# EAGLE design Versie 4 (EAGLE 7.3.0)

## Sheet 1 of 7: OVERVIEW
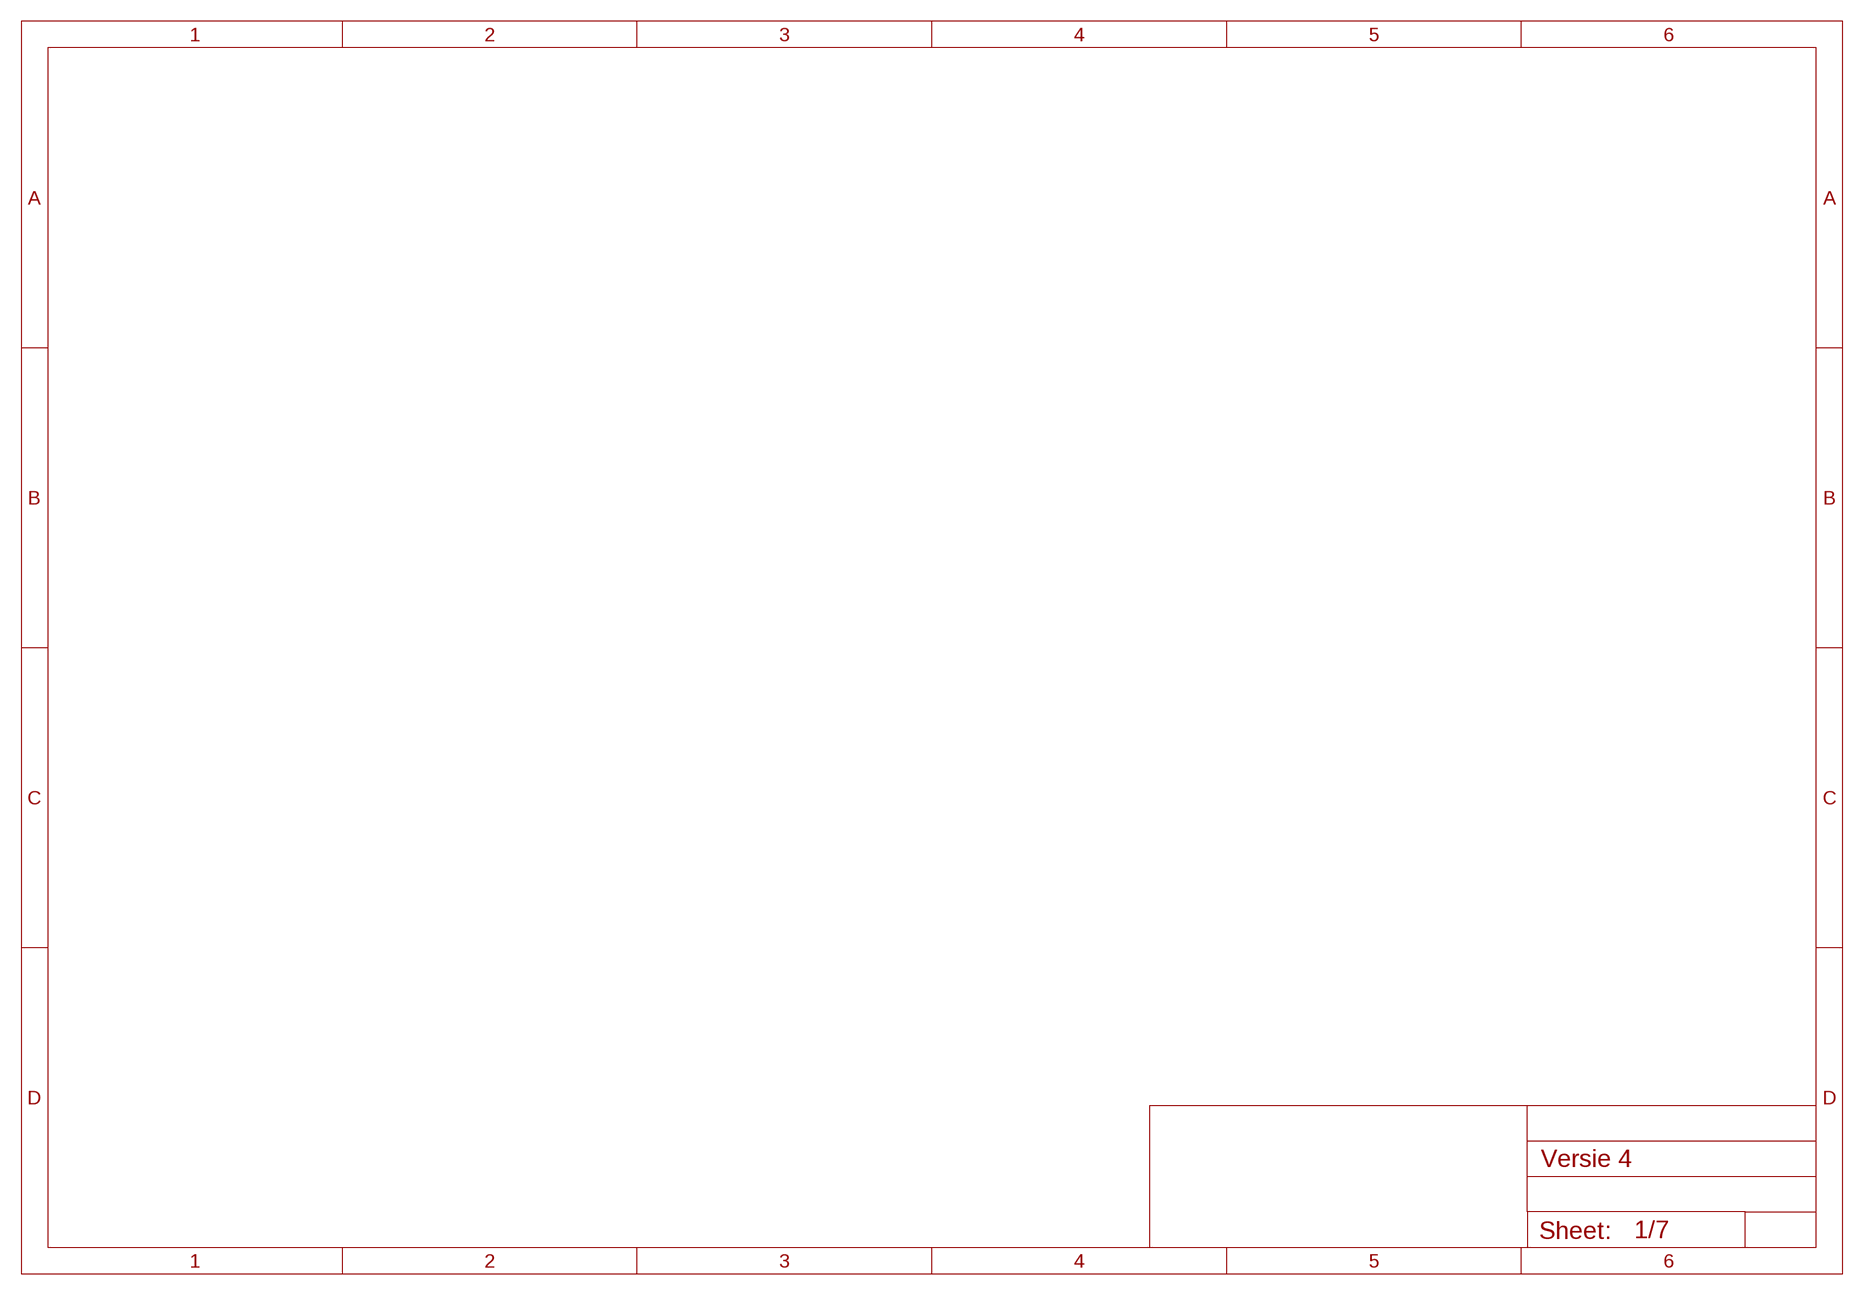
[diagram p0: schematic, sheet 1]

## Sheet 2 of 7: POWER
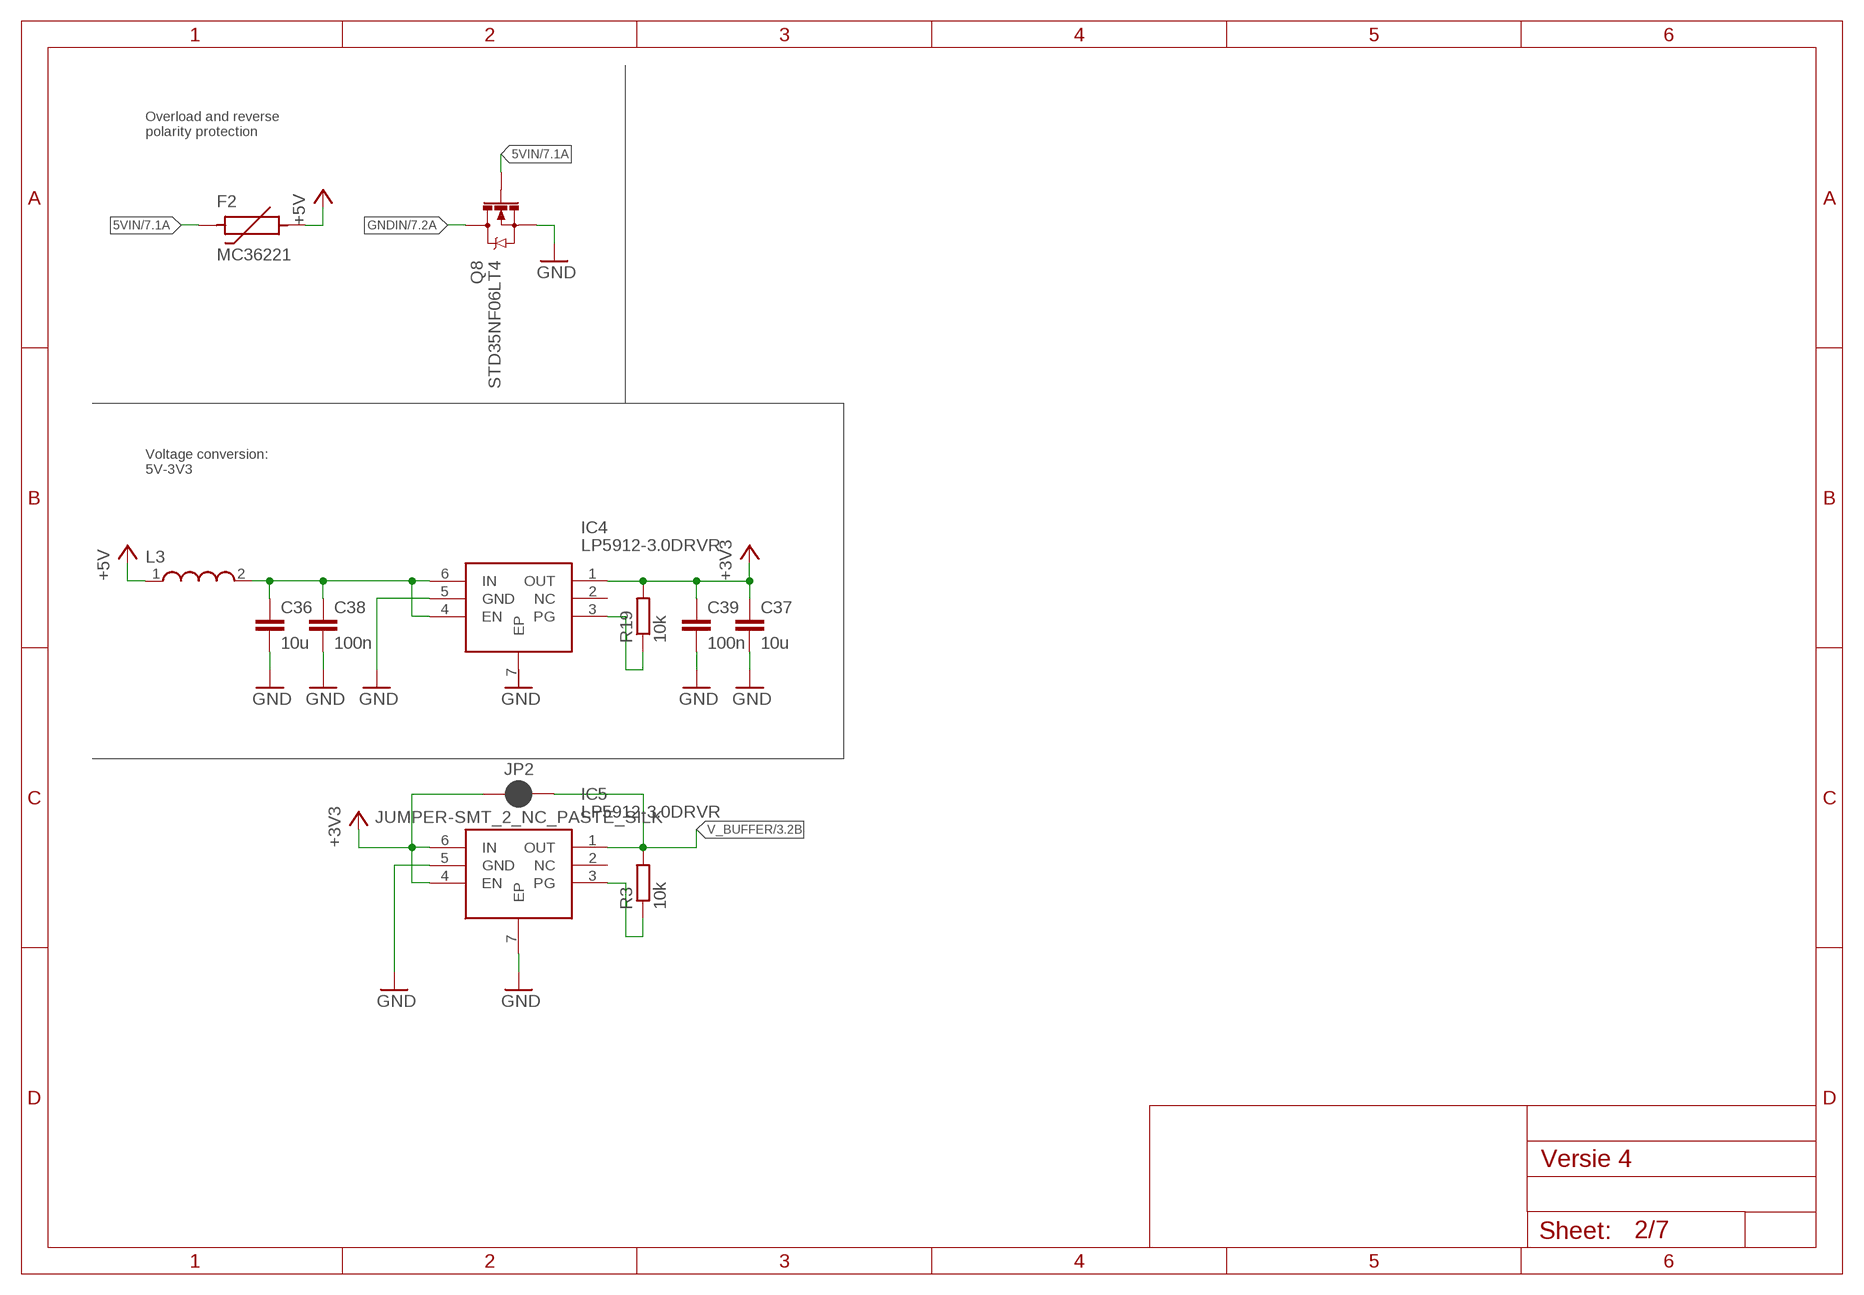
[diagram p1: schematic, sheet 2]

### Parts
C36  10u  C-EUC0603  [C0603]
C37  10u  C-EUC0603  [C0603]
C38  100n  C-EUC0603  [C0603]
C39  100n  C-EUC0603  [C0603]
F2  MC36221  [1206]
IC4  LP5912-3.0DRVR  [SON65P200X200X80-7N]
IC5  LP5912-3.0DRVR  [SON65P200X200X80-7N]
JP2  JUMPER-SMT_2_NC_PASTE_SILK  [SMT-JUMPER_2_NC_PASTE_SILK]
L3  WE-CBA_0603(WB/HS)  [WE-CBA_0603(W=2.2)]
Q8  STD35NF06LT4  MOSFET-NCHANNEL_SOT23-3  [SOT23-3]
R3  10k  R-EU_R0603  [R0603]
R19  10k  R-EU_R0603  [R0603]

### Nets
5VIN: F2.P$1 Q8.1(G) ; also sheet 7
+3V3: C37.1 C39.1 IC4.1(OUT) IC5.4(EN) IC5.6(IN) JP2.1 R19.2 ; also sheet 4,5,6,7
+5V: F2.P$2 L3.1
GND: C36.2 C37.2 C38.2 C39.2 IC4.5(GND) IC5.5(GND) IC5.7(EP) Q8.2(S) ; also sheet 3,4,5,6,7
GNDIN: Q8.3(D) ; also sheet 7
N$11: IC5.3(PG) R3.1
N$28: C36.1 C38.1 IC4.4(EN) IC4.6(IN) L3.2
N$29: IC4.3(PG) R19.1
V_BUFFER: IC5.1(OUT) JP2.2 R3.2 ; also sheet 3,4
Unconnected: IC4.2(NC) IC4.7(EP) IC5.2(NC)

### Notes on the sheet
- Overload and reverse
  polarity protection
- Voltage conversion:
  5V-3V3

## Sheet 3 of 7: PPS IN
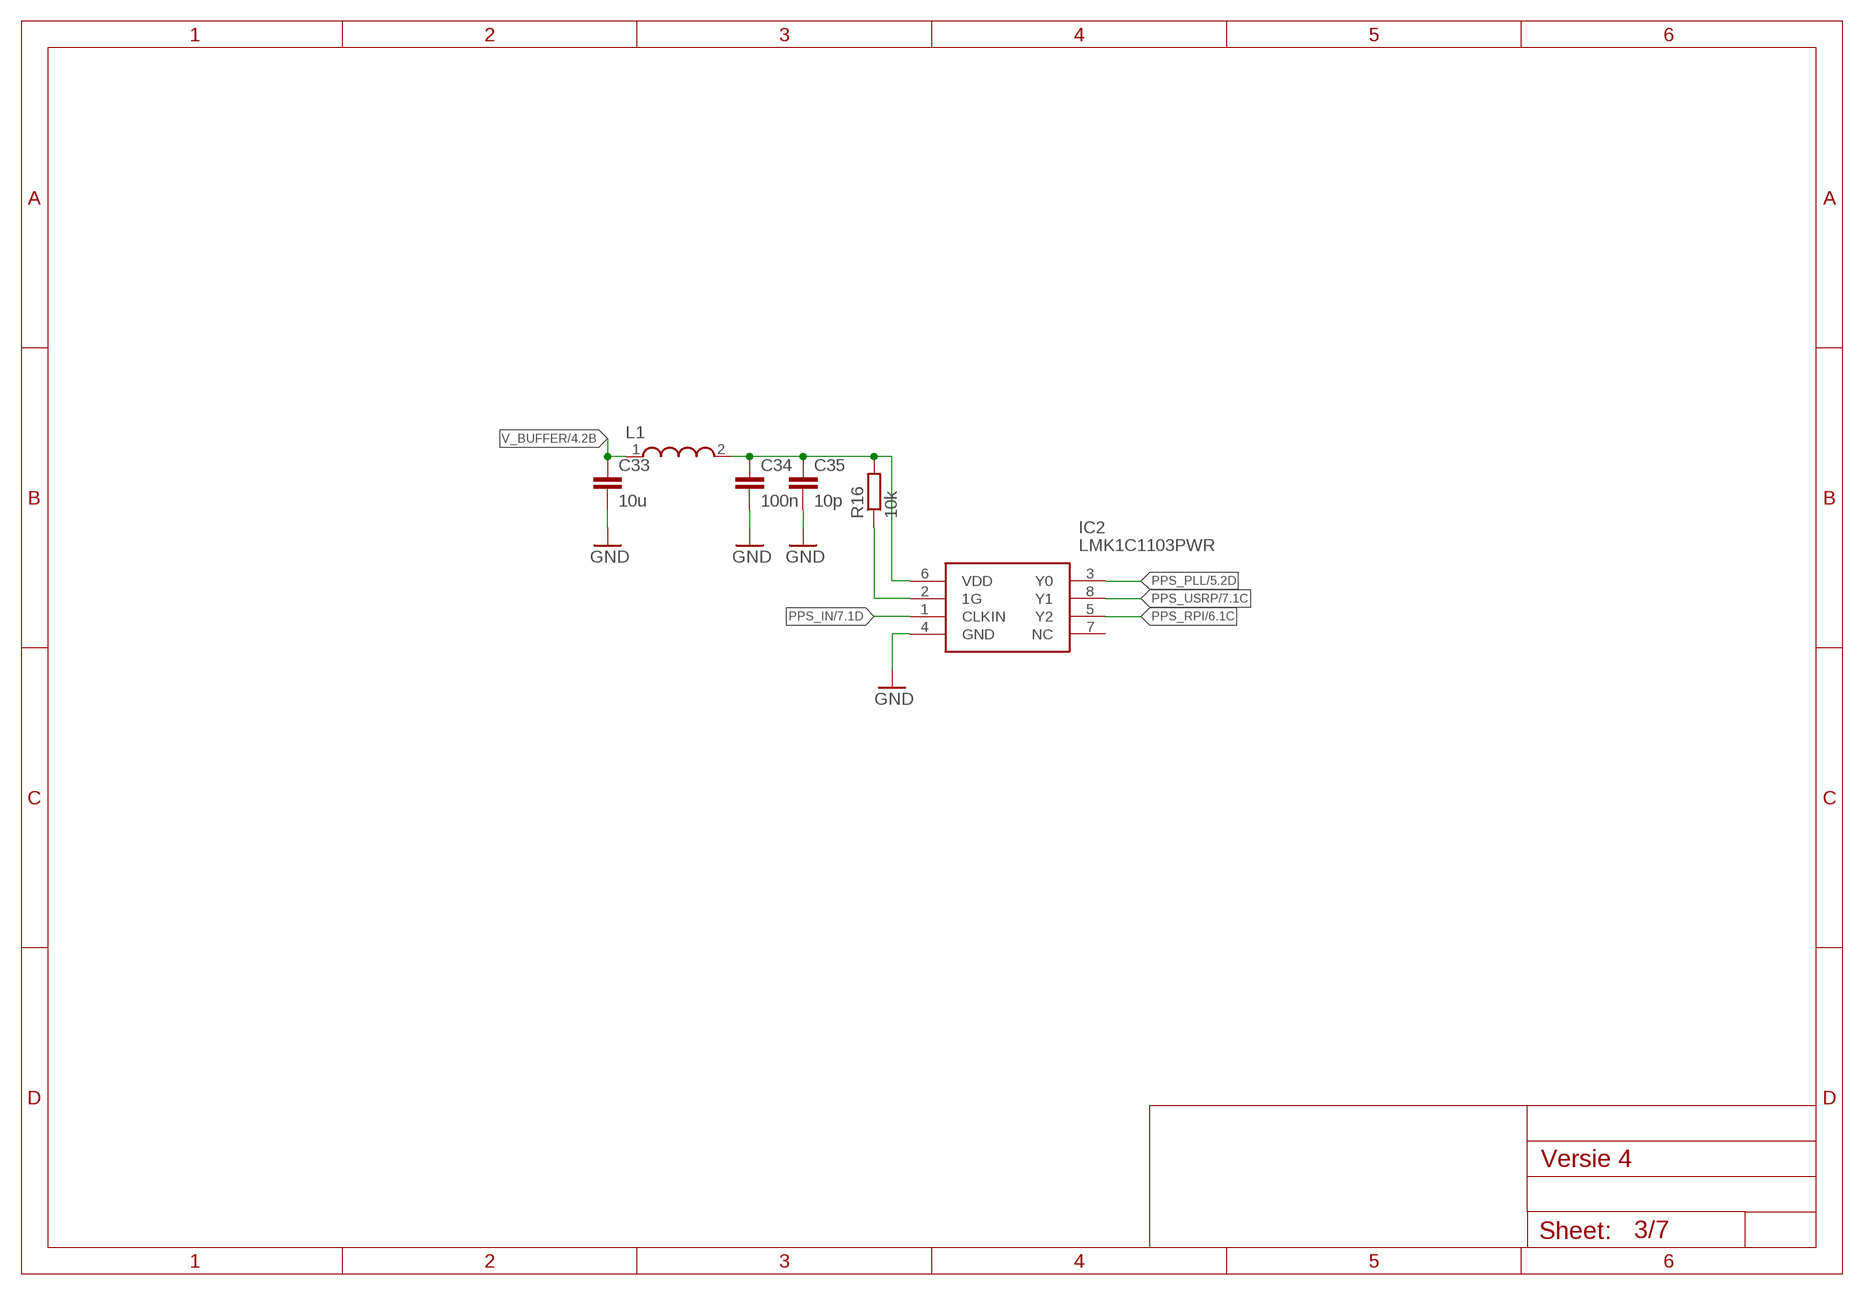
[diagram p2: schematic, sheet 3]

### Parts
C33  10u  C-EUC0603  [C0603]
C34  100n  C-EUC0603  [C0603]
C35  10p  C-EUC0603  [C0603]
IC2  LMK1C1103PWR  [SOP65P640X120-8N]
L1  WE-CBA_0603(WB/HS)  [WE-CBA_0603(W=2.2)]
R16  10k  R-EU_R0603  [R0603]

### Nets
GND: C33.2 C34.2 C35.2 IC2.4(GND) ; also sheet 2,4,5,6,7
N$22: IC2.2(1G) R16.1
N$24: C34.1 C35.1 IC2.6(VDD) L1.2 R16.2
PPS_IN: IC2.1(CLKIN) ; also sheet 7
PPS_PLL: IC2.3(Y0) ; also sheet 5
PPS_RPI: IC2.5(Y2) ; also sheet 6,7
PPS_USRP: IC2.8(Y1) ; also sheet 7
V_BUFFER: C33.1 L1.1 ; also sheet 2,4
Unconnected: IC2.7(NC)

## Sheet 4 of 7: 10MHz IN
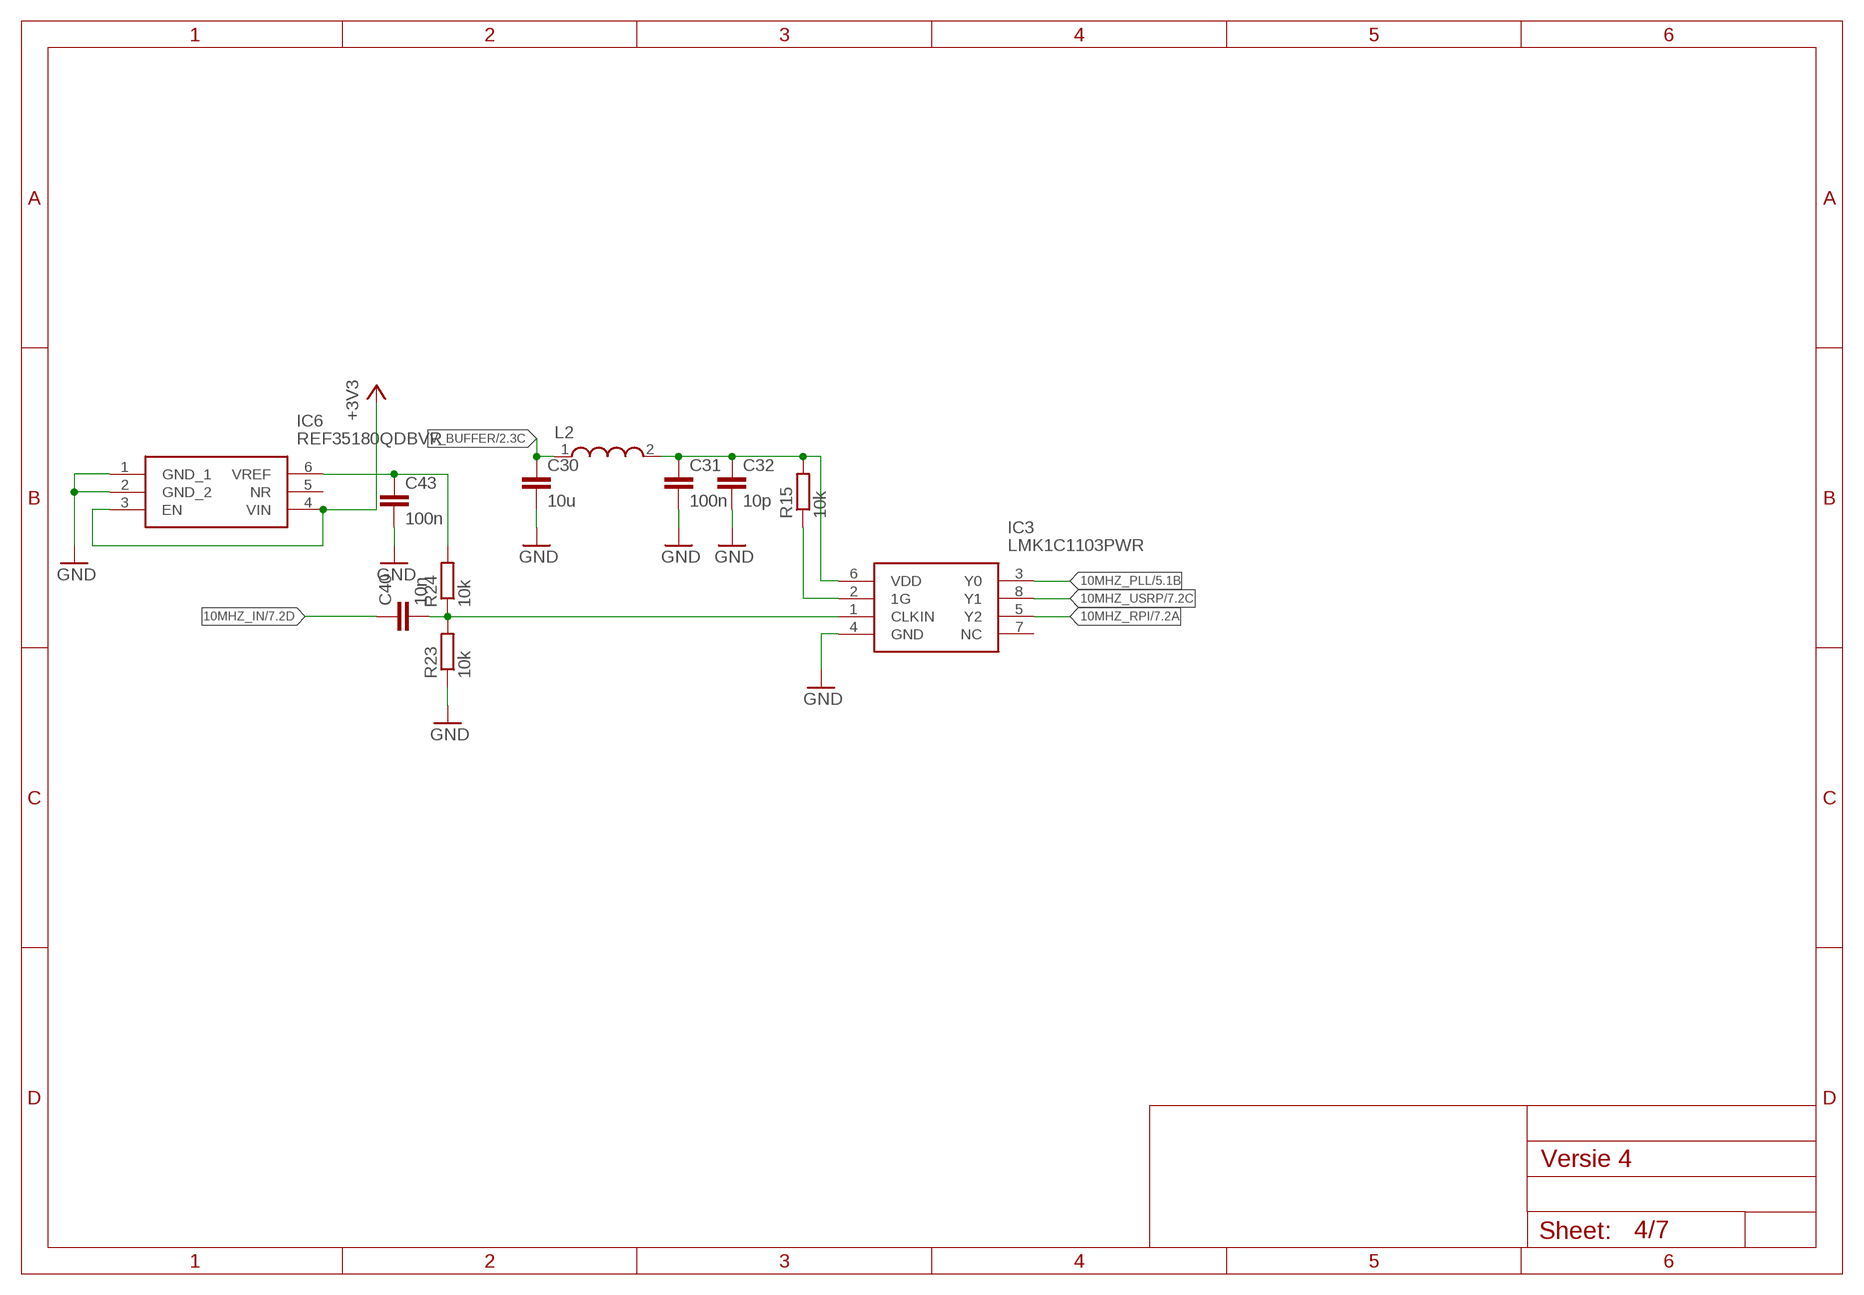
[diagram p3: schematic, sheet 4]

### Parts
C30  10u  C-EUC0603  [C0603]
C31  100n  C-EUC0603  [C0603]
C32  10p  C-EUC0603  [C0603]
C40  10n  C-EUC0603  [C0603]
C43  100n  C-EUC0603  [C0603]
IC3  LMK1C1103PWR  [SOP65P640X120-8N]
IC6  REF35180QDBVR  [SOT95P280X145-6N]
L2  WE-CBA_0603(WB/HS)  [WE-CBA_0603(W=2.2)]
R15  10k  R-EU_R0603  [R0603]
R23  10k  R-EU_R0603  [R0603]
R24  10k  R-EU_R0603  [R0603]

### Nets
10MHZ_IN: C40.1 ; also sheet 7
10MHZ_PLL: IC3.3(Y0) ; also sheet 5
10MHZ_RPI: IC3.5(Y2) ; also sheet 7
10MHZ_USRP: IC3.8(Y1) ; also sheet 7
+3V3: IC6.3(EN) IC6.4(VIN) ; also sheet 2,5,6,7
GND: C30.2 C31.2 C32.2 C43.2 IC3.4(GND) IC6.1(GND_1) IC6.2(GND_2) R23.1 ; also sheet 2,3,5,6,7
N$23: C40.2 IC3.1(CLKIN) R23.2 R24.1
N$25: IC3.2(1G) R15.1
N$27: C31.1 C32.1 IC3.6(VDD) L2.2 R15.2
N$30: C43.1 IC6.6(VREF) R24.2
V_BUFFER: C30.1 L2.1 ; also sheet 2,3
Unconnected: IC3.7(NC) IC6.5(NR)

## Sheet 5 of 7: PLL
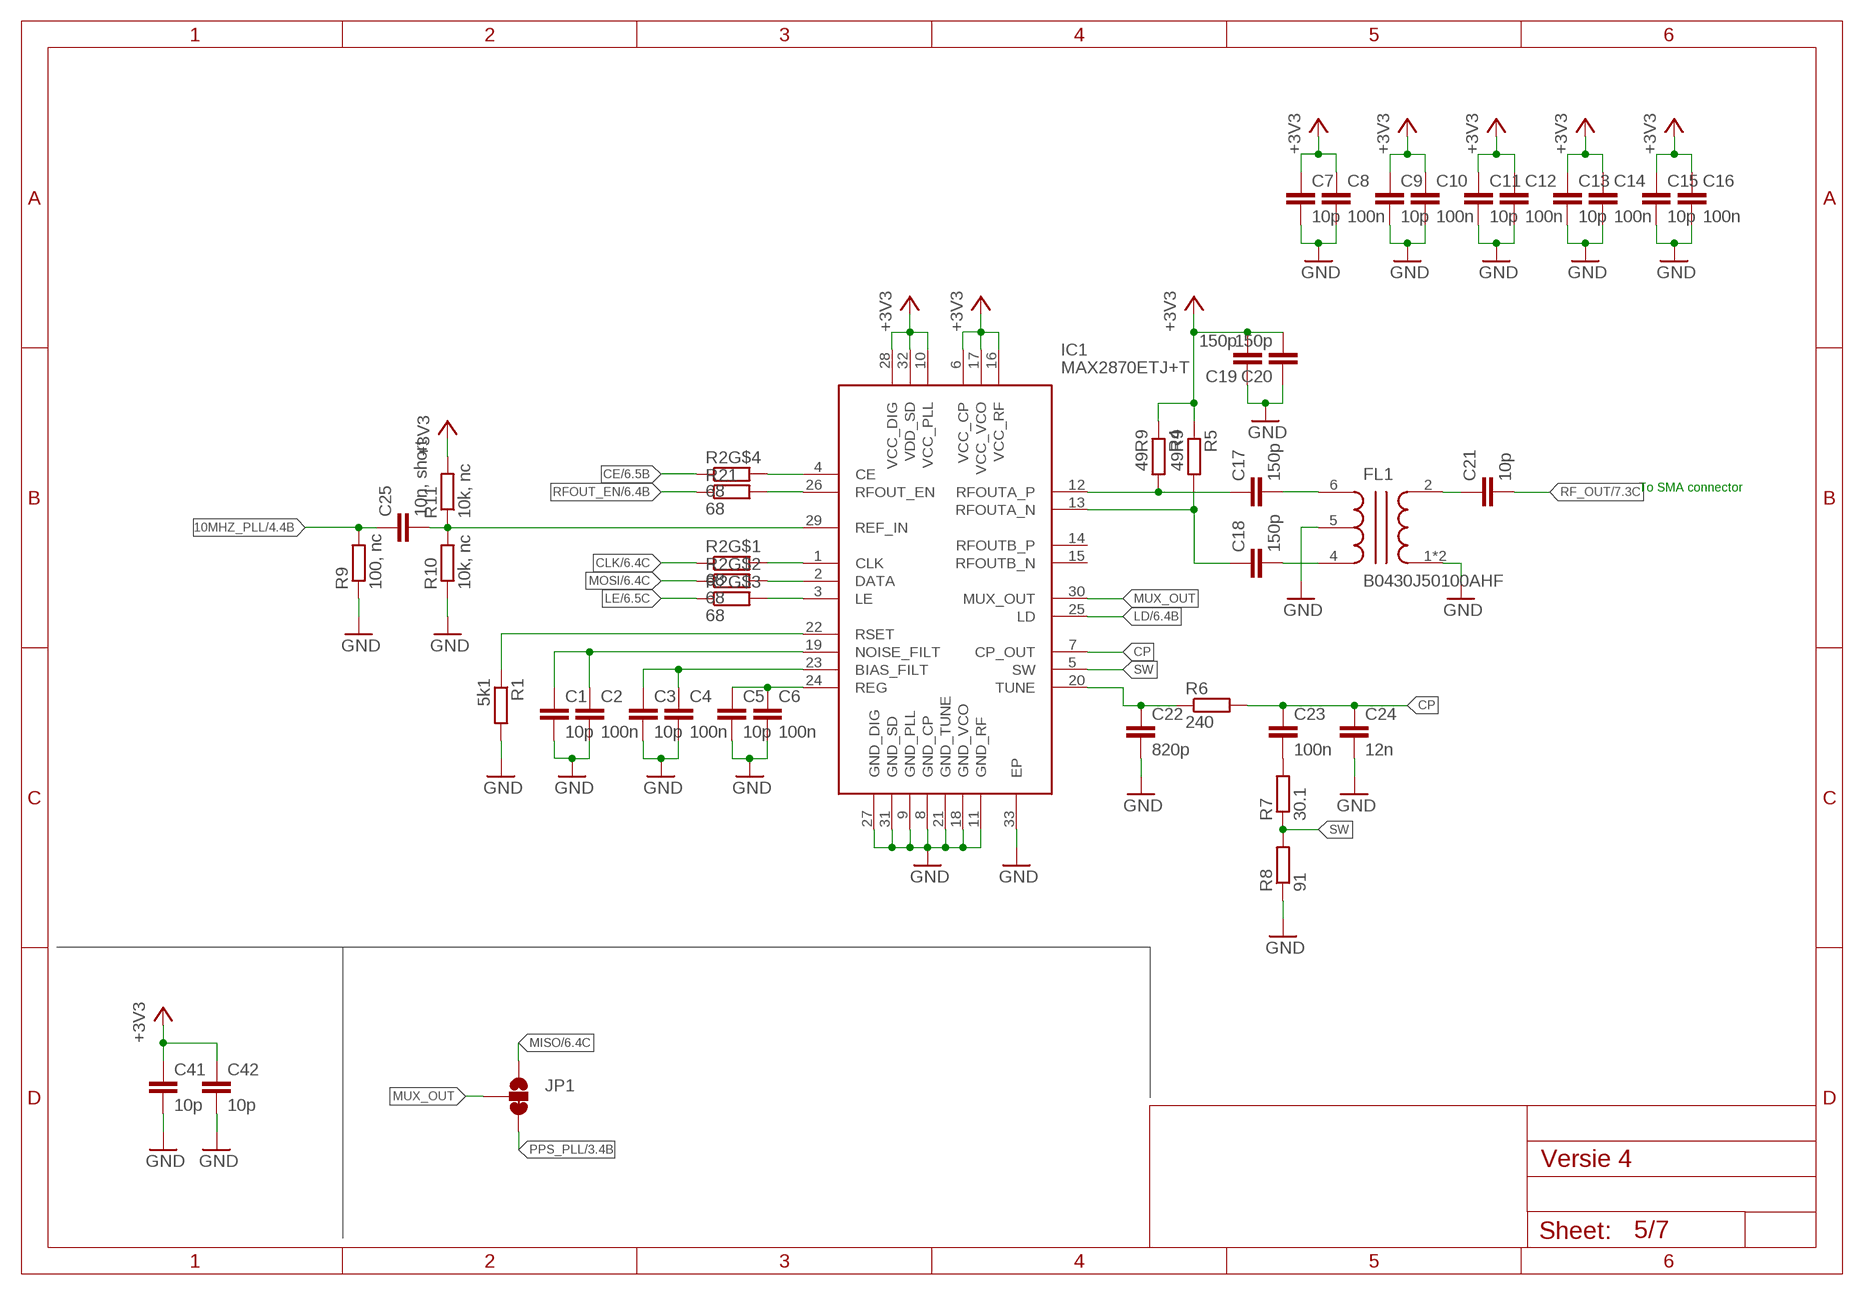
[diagram p4: schematic, sheet 5]

### Parts
C1  10p  C-EUC0603  [C0603]
C2  100n  C-EUC0603  [C0603]
C3  10p  C-EUC0603  [C0603]
C4  100n  C-EUC0603  [C0603]
C5  10p  C-EUC0603  [C0603]
C6  100n  C-EUC0603  [C0603]
C7  10p  C-EUC0603  [C0603]
C8  100n  C-EUC0603  [C0603]
C9  10p  C-EUC0603  [C0603]
C10  100n  C-EUC0603  [C0603]
C11  10p  C-EUC0603  [C0603]
C12  100n  C-EUC0603  [C0603]
C13  10p  C-EUC0603  [C0603]
C14  100n  C-EUC0603  [C0603]
C15  10p  C-EUC0603  [C0603]
C16  100n  C-EUC0603  [C0603]
C17  150p  C-EUC0402  [C0402]
C18  150p  C-EUC0402  [C0402]
C19  150p  C-EUC0402  [C0402]
C20  150p  C-EUC0402  [C0402]
C21  10p  C-EUC0402  [C0402]
C22  820p  C-EUC0603  [C0603]
C23  100n  C-EUC0603  [C0603]
C24  12n  C-EUC0603  [C0603]
C25  10n, short  C-EUC0603  [C0603]
C41  10p  C-EUC0603  [C0603]
C42  10p  C-EUC0603  [C0603]
FL1  B0430J50100AHF  [B0430J50100AHF]
IC1  MAX2870ETJ+T  [QFN50P500X500X80-33N]
JP1  JUMPER-SMT_3_1-NC_TRACE_SILK  [SMT-JUMPER_3_1-NC_TRACE_SILK]
R1  5k1  R-EU_R0603  [R0603]
R2  68  CAY16A-2002F4LF  [CAY16A1003F4LF]
R4  49R9  R-EU_R0402  [R0402]
R5  49R9  R-EU_R0402  [R0402]
R6  240  R-EU_R0603  [R0603]
R7  30.1  R-EU_R0603  [R0603]
R8  91  R-EU_R0603  [R0603]
R9  100, nc  R-EU_R0603  [R0603]
R10  10k, nc  R-EU_R0603  [R0603]
R11  10k, nc  R-EU_R0603  [R0603]
R21  68  R-EU_R0603  [R0603]

### Nets
10MHZ_PLL: C25.1 R9.2 ; also sheet 4
+3V3: C7.1 C8.1 C9.1 C10.1 C11.1 C12.1 C13.1 C14.1 C15.1 C16.1 C19.2 C20.2 C41.1 C42.1 IC1.6(VCC_CP) IC1.10(VCC_PLL) IC1.16(VCC_RF) IC1.17(VCC_VCO) IC1.28(VCC_DIG) IC1.32(VDD_SD) R4.1 R5.1 R11.2 ; also sheet 2,4,6,7
CE: R2.4 ; also sheet 6
CLK: R2.1 ; also sheet 6
CP: C23.1 C24.1 IC1.7(CP_OUT) R6.2
GND: C1.2 C2.2 C3.2 C4.2 C5.2 C6.2 C7.2 C8.2 C9.2 C10.2 C11.2 C12.2 C13.2 C14.2 C15.2 C16.2 C19.1 C20.1 C22.2 C24.2 C41.2 C42.2 FL1.1(GND_1) FL1.3(GND_1) FL1.5(NC) IC1.8(GND_CP) IC1.9(GND_PLL) IC1.11(GND_RF) IC1.18(GND_VCO) IC1.21(GND_TUNE) IC1.27(GND_DIG) IC1.31(GND_SD) IC1.33(EP) R1.2 R8.1 R9.1 R10.1 ; also sheet 2,3,4,6,7
LD: IC1.25(LD) ; also sheet 6
LE: R2.3 ; also sheet 6
MISO: JP1.1 ; also sheet 6
MOSI: R2.2 ; also sheet 6
MUX_OUT: IC1.30(MUX_OUT) JP1.2
N$1: C5.1 C6.1 IC1.24(REG)
N$2: IC1.22(RSET) R1.1
N$3: IC1.1(CLK) R2.8
N$4: IC1.2(DATA) R2.7
N$5: IC1.3(LE) R2.6
N$6: C1.1 C2.1 IC1.19(NOISE_FILT)
N$7: C3.1 C4.1 IC1.23(BIAS_FILT)
N$8: IC1.26(RFOUT_EN) R21.2
N$9: IC1.4(CE) R2.5
N$10: C22.1 IC1.20(TUNE) R6.1
N$12: C17.1 IC1.12(RFOUTA_P) R4.2
N$13: C18.1 IC1.13(RFOUTA_N) R5.2
N$14: C18.2 FL1.4(BALANCED_PORT_1)
N$15: C17.2 FL1.6(BALANCED_PORT_2)
N$16: C23.2 R7.2
N$17: C25.2 IC1.29(REF_IN) R10.2 R11.1
N$18: C21.1 FL1.2(UNBALANCED)
PPS_PLL: JP1.3 ; also sheet 3
RF_OUT: C21.2 ; also sheet 7
RFOUT_EN: R21.1 ; also sheet 6
SW: IC1.5(SW) R7.1 R8.2
Unconnected: IC1.14(RFOUTB_P) IC1.15(RFOUTB_N)

### Notes on the sheet
- To SMA connector

## Sheet 6 of 7: MCU
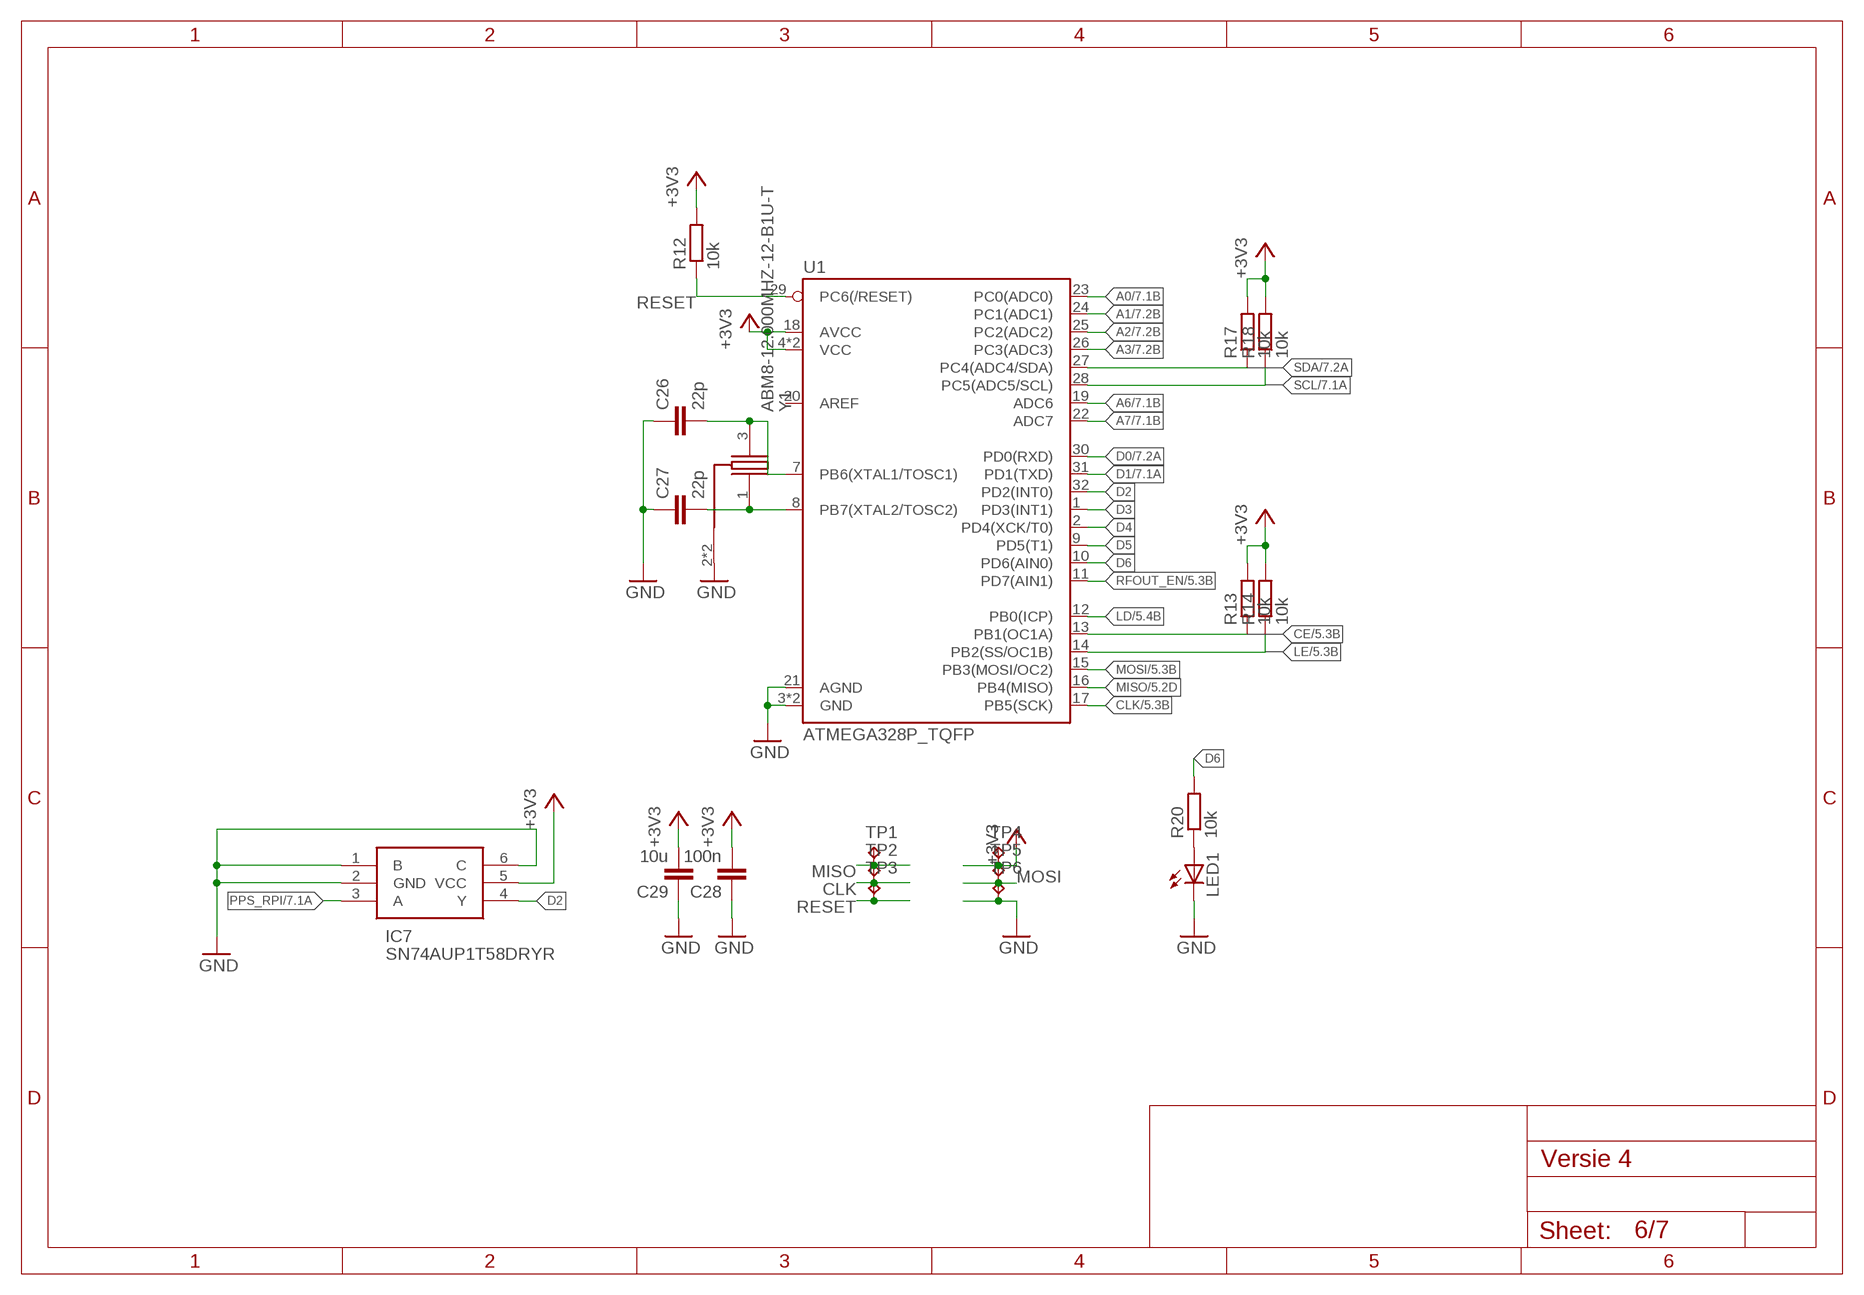
[diagram p5: schematic, sheet 6]

### Parts
C26  22p  C-EUC0603  [C0603]
C27  22p  C-EUC0603  [C0603]
C28  100n  C-EUC0603  [C0603]
C29  10u  C-EUC0603  [C0603]
IC7  SN74AUP1T58DRYR  [SON50P100X145X60-6N]
LED1  LEDCHIPLED_0603  [CHIPLED_0603]
R12  10k  R-EU_R0603  [R0603]
R13  10k  R-EU_R0603  [R0603]
R14  10k  R-EU_R0603  [R0603]
R17  10k  R-EU_R0603  [R0603]
R18  10k  R-EU_R0603  [R0603]
R20  10k  R-EU_R0603  [R0603]
TP1  TPTP16R  [TP16R]
TP2  TPTP16R  [TP16R]
TP3  TPTP16R  [TP16R]
TP4  TPTP16R  [TP16R]
TP5  TPTP16R  [TP16R]
TP6  TPTP16R  [TP16R]
U1  ATMEGA328P_TQFP  [TQFP32-08]
Y1  ABM8-12.000MHZ-12-B1U-T  [ABM810000MHZ12D2W]

### Nets
+3V3: C28.2 C29.2 IC7.5(VCC) R12.2 R13.2 R14.2 R17.2 R18.2 TP4.TP U1.4(VCC) U1.6(VCC) U1.18(AVCC) ; also sheet 2,4,5,7
A0: U1.23(PC0(ADC0)) ; also sheet 7
A1: U1.24(PC1(ADC1)) ; also sheet 7
A2: U1.25(PC2(ADC2)) ; also sheet 7
A3: U1.26(PC3(ADC3)) ; also sheet 7
A6: U1.19(ADC6) ; also sheet 7
A7: U1.22(ADC7) ; also sheet 7
CE: R13.1 U1.13(PB1(OC1A)) ; also sheet 5
CLK: TP2.TP U1.17(PB5(SCK)) ; also sheet 5
D0: U1.30(PD0(RXD)) ; also sheet 7
D1: U1.31(PD1(TXD)) ; also sheet 7
D2: IC7.4(Y) U1.32(PD2(INT0))
D3: U1.1(PD3(INT1))
D4: U1.2(PD4(XCK/T0))
D5: U1.9(PD5(T1))
D6: R20.2 U1.10(PD6(AIN0))
GND: C26.1 C27.1 C28.1 C29.1 IC7.1(B) IC7.2(GND) IC7.6(C) LED1.C TP6.TP U1.3(GND) U1.5(GND) U1.21(AGND) Y1.2(GND_1) Y1.4(GND_1) ; also sheet 2,3,4,5,7
LD: U1.12(PB0(ICP)) ; also sheet 5
LE: R14.1 U1.14(PB2(SS/OC1B)) ; also sheet 5
MISO: TP1.TP U1.16(PB4(MISO)) ; also sheet 5
MOSI: TP5.TP U1.15(PB3(MOSI/OC2)) ; also sheet 5
N$19: LED1.A R20.1
N$20: C26.2 U1.7(PB6(XTAL1/TOSC1)) Y1.3(X2)
N$21: C27.2 U1.8(PB7(XTAL2/TOSC2)) Y1.1(X1)
PPS_RPI: IC7.3(A) ; also sheet 3,7
RESET: R12.1 TP3.TP U1.29(PC6(/RESET))
RFOUT_EN: U1.11(PD7(AIN1)) ; also sheet 5
SCL: R18.1 U1.28(PC5(ADC5/SCL)) ; also sheet 7
SDA: R17.1 U1.27(PC4(ADC4/SDA)) ; also sheet 7
Unconnected: U1.20(AREF)

## Sheet 7 of 7: CONNECTORS
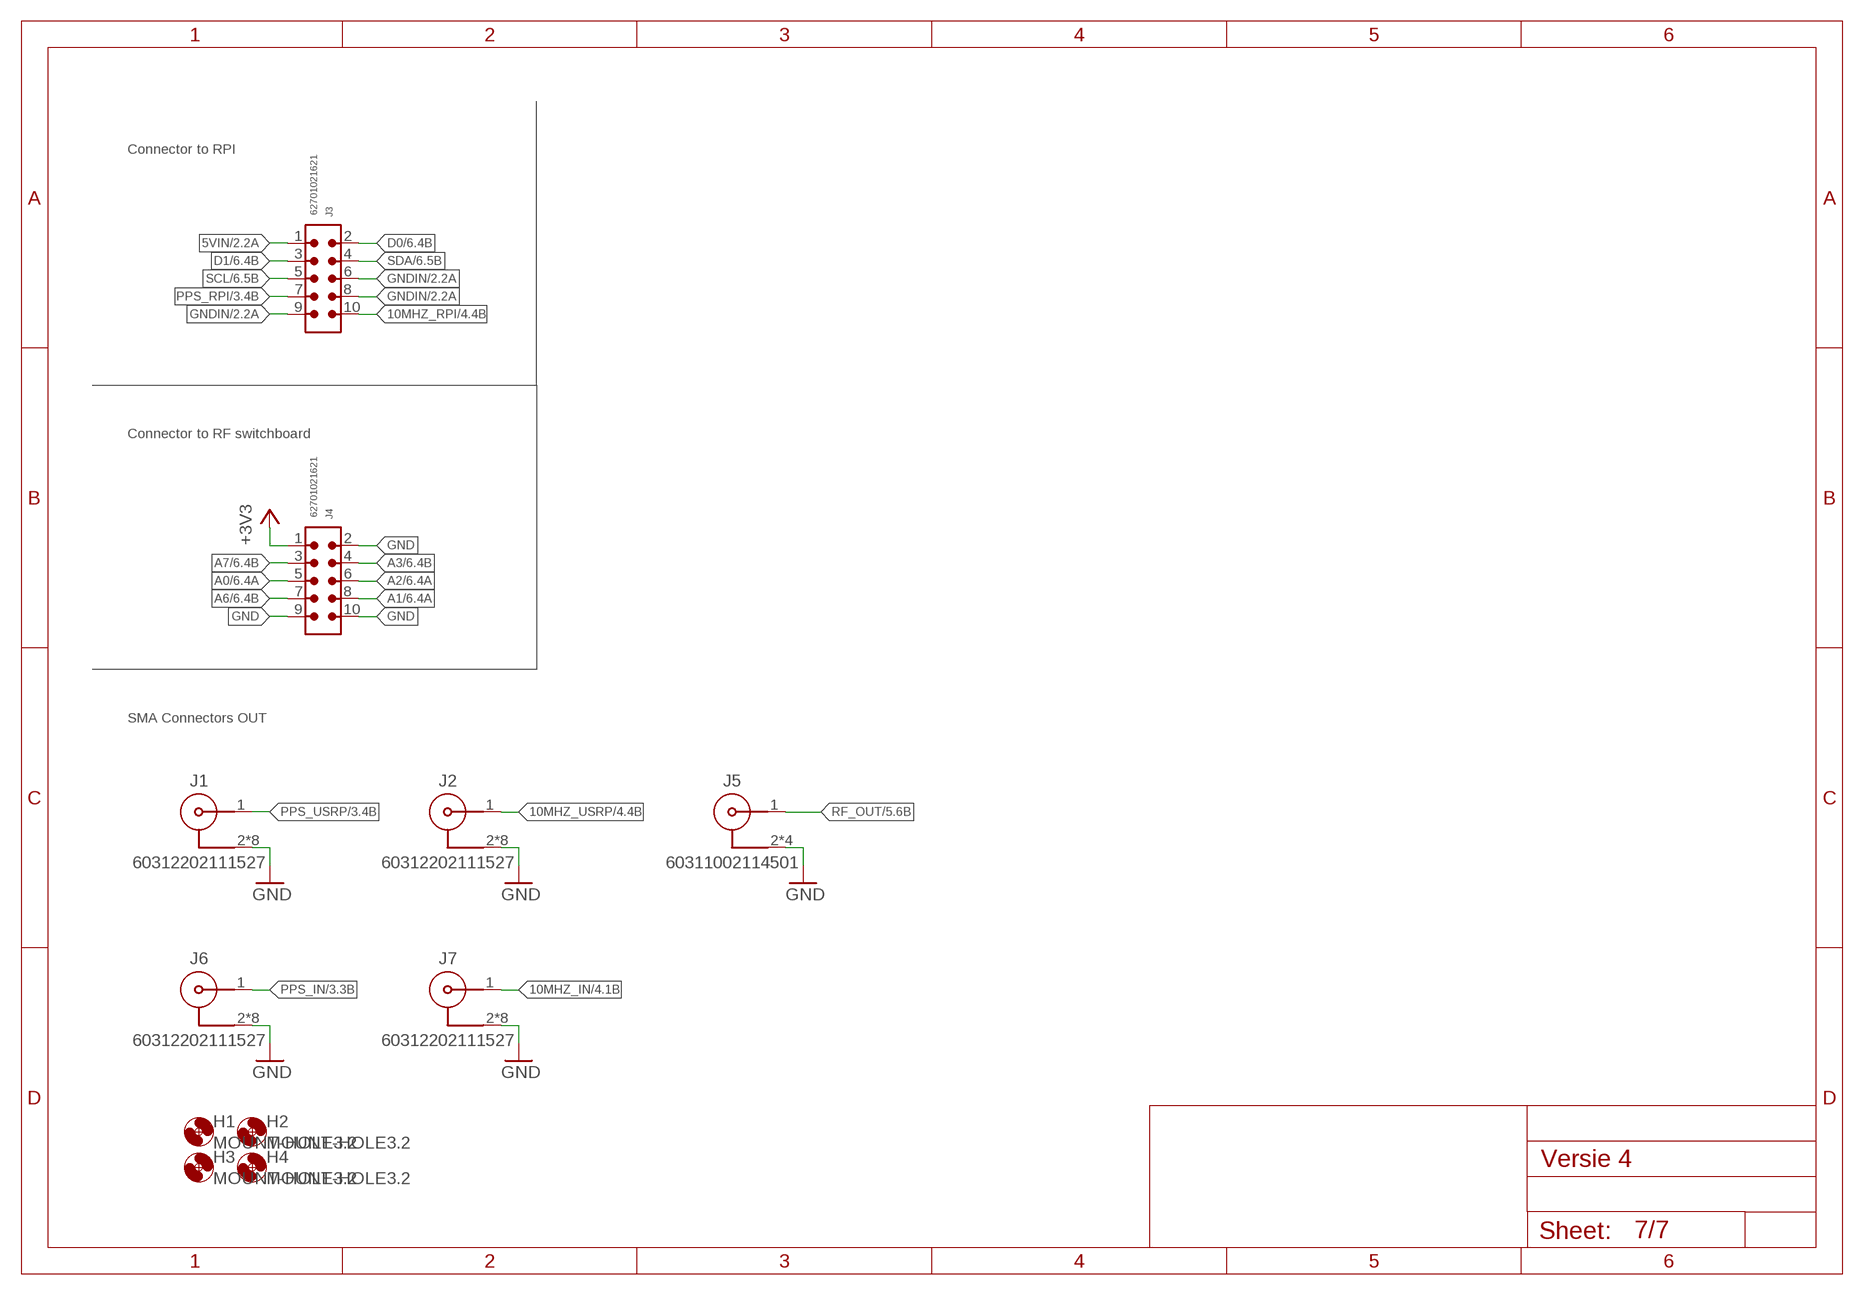
[diagram p6: schematic, sheet 7]

### Parts
H1  MOUNT-HOLE3.2  [3,2]
H2  MOUNT-HOLE3.2  [3,2]
H3  MOUNT-HOLE3.2  [3,2]
H4  MOUNT-HOLE3.2  [3,2]
J1  60312202111527  [60312202111527]
J2  60312202111527  [60312202111527]
J3  62701021621  6270XX21621_62701021621  [62701021621]
J4  62701021621  6270XX21621_62701021621  [62701021621]
J5  60311002114501  [60311002114501]
J6  60312202111527  [60312202111527]
J7  60312202111527  [60312202111527]

### Nets
5VIN: J3.1 ; also sheet 2
10MHZ_IN: J7.1 ; also sheet 4
10MHZ_RPI: J3.10 ; also sheet 4
10MHZ_USRP: J2.1 ; also sheet 4
+3V3: J4.1 ; also sheet 2,4,5,6
A0: J4.5 ; also sheet 6
A1: J4.8 ; also sheet 6
A2: J4.6 ; also sheet 6
A3: J4.4 ; also sheet 6
A6: J4.7 ; also sheet 6
A7: J4.3 ; also sheet 6
D0: J3.2 ; also sheet 6
D1: J3.3 ; also sheet 6
GND: J1.2 J1.3 J1.4 J1.5 J1.7 J1.8 J1.9 J1.10 J2.2 J2.3 J2.4 J2.5 J2.7 J2.8 J2.9 J2.10 J4.2 J4.9 J4.10 J5.2 J5.3 J5.4 J5.5 J6.2 J6.3 J6.4 J6.5 J6.7 J6.8 J6.9 J6.10 J7.2 J7.3 J7.4 J7.5 J7.7 J7.8 J7.9 J7.10 ; also sheet 2,3,4,5,6
GNDIN: J3.6 J3.8 J3.9 ; also sheet 2
PPS_IN: J6.1 ; also sheet 3
PPS_RPI: J3.7 ; also sheet 3,6
PPS_USRP: J1.1 ; also sheet 3
RF_OUT: J5.1 ; also sheet 5
SCL: J3.5 ; also sheet 6
SDA: J3.4 ; also sheet 6

### Notes on the sheet
- Connector to RPI
- Connector to RF switchboard
- SMA Connectors OUT

## Library data of the parts
C1-C43 = rcl:C-EU: CAPACITOR, European symbol
F2 = multicomp-resettable-fuse:MC36221
FL1 = balun:B0430J50100AHF: Signal Conditioning 400-3000MHz 50/100 Ohm IL=4.0dB Source: Datasheet <https://componentsearchengine.com/Datasheets/1/B0430J50100AHF.pdf>; DESCRIPTION: Signal Conditioning 400-3000MHz 50/100 Ohm IL=4.0dB; HEIGHT: 0.7mm; MANUFACTURER_NAME: ANAREN; MANUFACTURER_PART_NUMBER: B0430J50100AHF; MOUSER_PART_NUMBER: 620-B0430J50100AHF; MOUSER_PRICE-STOCK: https://www.mouser.co.uk/ProductDetail/Anaren/B0430J50100AHF?qs=61pwXRo0i5hJ5yOyYTWnSA%3D%3D
H1-H4 = holes:MOUNT-HOLE: MOUNTING HOLE with drill center marker
IC1 = max2870:MAX2870ETJ+T: Phase Locked Loops - PLL PLL/VCO Source: Datasheet <https://datasheets.maximintegrated.com/en/ds/MAX2870.pdf>; DESCRIPTION: Phase Locked Loops - PLL PLL/VCO; HEIGHT: 0.8mm; MANUFACTURER_NAME: Analog Devices; MANUFACTURER_PART_NUMBER: MAX2870ETJ+T; MOUSER_PART_NUMBER: 700-MAX2870ETJ+T; MOUSER_PRICE-STOCK: https://www.mouser.co.uk/ProductDetail/Analog-Devices-Maxim-Integrated/MAX2870ETJ%2bT?qs=UFD7vfw3J8rIUAsp8guXHg%3D%3D
IC2 IC3 = lmk1c110x:LMK1C1103PWR: Clock Buffer 3-channel output LVCMOS 1.8-V buffer 8-TSSOP -40 to 125 Source: Datasheet <https://www.ti.com/lit/ds/symlink/lmk1c1103.pdf?ts=1603742885821&ref_url=https%3A%2F%2Fwww.ti.com%2Fproduct%2FLMK1C1103>; DESCRIPTION: Clock Buffer 3-channel output LVCMOS 1.8-V buffer 8-TSSOP -40 to 125; HEIGHT: 1.2mm; MANUFACTURER_NAME: Texas Instruments; MANUFACTURER_PART_NUMBER: LMK1C1103PWR; MOUSER_PART_NUMBER: 595-LMK1C1103PWR; MOUSER_PRICE-STOCK: https://www.mouser.co.uk/ProductDetail/Texas-Instruments/LMK1C1103PWR?qs=rI7uf1IzohQWIx%2FERNzyRA%3D%3D
IC4 IC5 = lp5912:LP5912-3.0DRVR: 500-mA low-noise low-IQ low-dropout (LDO) linear regulator Source: Datasheet <http://www.ti.com/lit/gpn/lp5912>; DESCRIPTION: 500-mA low-noise low-IQ low-dropout (LDO) linear regulator; HEIGHT: 0.8mm; MANUFACTURER_NAME: Texas Instruments; MANUFACTURER_PART_NUMBER: LP5912-3.0DRVR; MOUSER_PART_NUMBER: 595-LP5912-3.0DRVR; MOUSER_PRICE-STOCK: https://www.mouser.co.uk/ProductDetail/Texas-Instruments/LP5912-3.0DRVR?qs=yBt6ao%2FxsTzuXuKE9NcTCg%3D%3D
IC6 = voltage-ref:REF35180QDBVR: Voltage References 650-nA quiescent current, 12-ppm/C drift, ultra-low-power precision voltage reference Source: Datasheet <https://www.arrow.com/en/products/ref35180qdbvr/texas-instruments?region=nac>; DESCRIPTION: Voltage References 650-nA quiescent current, 12-ppm/C drift, ultra-low-power precision voltage reference; HEIGHT: 1.45mm; MANUFACTURER_NAME: Texas Instruments; MANUFACTURER_PART_NUMBER: REF35180QDBVR; MOUSER_PART_NUMBER: 595-REF35180QDBVR; MOUSER_PRICE-STOCK: https://www.mouser.co.uk/ProductDetail/Texas-Instruments/REF35180QDBVR?qs=rQFj71Wb1eXMxDy8CoLU1Q%3D%3D
IC7 = SamacSys_Parts:SN74AUP1T58DRYR: SINGLE-SUPPLY VOLTAGE-LEVEL TRANSLATOR WITH NINE CONFIGURABLE GATE LOGIC FUNCTIONS Source: Datasheet <http://www.ti.com/lit/gpn/sn74aup1t58>; DESCRIPTION: SINGLE-SUPPLY VOLTAGE-LEVEL TRANSLATOR WITH NINE CONFIGURABLE GATE LOGIC FUNCTIONS; HEIGHT: mm; MANUFACTURER_NAME: Texas Instruments; MANUFACTURER_PART_NUMBER: SN74AUP1T58DRYR
J1 J2 J6 J7 = Eagle_WR-SMA (rev23a):60312202111527: WR-SMA PCB End Launch Characteristics Interface: MIL-STD-348 Mating Cycle: 500 Cycles Impedance: 50Ω Insulation Resistance: 5000MΩ(min.) Withstanding Voltage: 1000Vrms(min.) Ingress Protection: None l IP67 Mating: Screw (Recommended by torque wrench tool) Applications Network and communications RF Test and measurement equipment Industrial applications Electronic consumers and device Outdoor or humid environment <https://www.we-online.com/components/media/o122886v209%20Family-WR-SMA%20End%20Launch%20Connectors.jpg> Details see: www.we-online.com/components/products/COAX_SMA_CONNECTOR_PCB_END_LAUNCH <www.we-online.com/catalog/COAX_SMA_CONNECTOR_PCB_END_LAUNCH/?utm_source=eagle_model&utm_medium=description_link&utm_campaign=eisos_eagle> Updated by Ella Wu 2023-10-10 2023(C) Würth Elektronik; DATASHEET-URL: https://www.we-online.com/redexpert/spec/60312202111527?ae; FREQUENCY-RANGE: DC~18 GHz; IMPEDANCE: 50Ohm; INTERFACE: MIL-STD-348; MOUNT: End Launch; PART-NUMBER: 60312202111527; SIZE: Straight Jack
J3 J4 = Eagle_WR-BHD (rev22c):6270XX21621_62701021621: WR-BHD 1.27 mm Male Box Header KIND PROPERTIES: Pitch 1.27 mm Gender:Male MATERIAL PROPERTIES: Insulator Material Nylon 9T Insulator Flammability Rating UL94 V-0 Insulator Color Black Contact Material Brass Contact Plating Gold over Nickel GENERAL INFORMATION: Operating Temperature -40 up to +105 °C Working Voltage 50 V (AC) Withstanding Voltage 500 V (AC) Contact Resistance 20 mΩ RISO 1000 MΩ CERTIFICATION: UL Approval E323964 <https://www.we-online.com/catalog/media/o375404v209%20Family_WR-BHD_6270xx21621.jpg> Details see: https://www.we-online.com/catalog/en/WR_BHD_1_27_MM_MALE_BOX_HEADER Created by Ella Wu 2021-08-24 2021 (C) Würth Elektronik; CONTACT-RESISTANCE: 20mOhm; DATASHEET-URL: https://www.we-online.com/redexpert/spec/62701021621?ae; GENDER: Male; IR: 1A; LENGTH: 12.7mm; MOUNT: THT; PART-NUMBER: 62701021621; PINS: 10; PITCH: 1.27mm; TYPE: Straight; WORKING-VOLTAGE: 50V(AC)
J5 = Eagle_WR-SMA (rev23a):60311002114501: WR-SMA PCB THT/THR/SMT Characteristics Interface: MIL-STD-348 Mating Cycle: 500 Cycles Impedance: 50Ω Insulation Resistance: 5000MΩ(min.) Withstanding Voltage: 1000Vrms(min.) Ingress Protection: None l IP67 Mating: Screw (Recommended by torque wrench tool) Applications Network and communications RF Test and measurement equipment Industrial applications Electronic consumers and device Outdoor or humidity environment <https://www.we-online.com/components/media/o176646v209%20Family-WR-SMA%20Cable%20Connectors.jpg> Details see: www.we-online.com/components/products/COAX_SMA_CONNECTOR_PCB_THT_THR_SMT <www.we-online.com/catalog/COAX_SMA_CONNECTOR_PCB_THT_THR_SMT/?utm_source=eagle_model&utm_medium=description_link&utm_campaign=eisos_eagle> Updated by Ella Wu 2023-10-10 2023(C) Würth Elektronik; DATASHEET-URL: https://www.we-online.com/redexpert/spec/60311002114501?ae; FREQUENCY-RANGE: DC~18 GHz; IMPEDANCE: 50Ohm; INTERFACE: MIL-STD-348; MOUNT: THT; PART-NUMBER: 60311002114501; SIZE: Right Angle Jack
JP1 = SparkFun-Jumpers:JUMPER-SMT_3_1-NC_TRACE: Normally closed trace jumper (1 of 2 connections) This jumper has a trace between two pads so it's normally closed (NC). The other connection is normally open (NO). Use a razor knife to open the connection. For best results follow the IPC guidelines for cutting traces: Cutout at least 0.063 mm (0.005 in). Remove all loose material to clean up the cut area. Seal the cut with an approved epoxy. Reapply solder to reclose the connection, or to close the NO connection.
JP2 = SparkFun-Jumpers:JUMPER-SMT_2_NC_PASTE: Normally closed solder jumper This jumper has an aperture in the stencil to allow solder paste to bridge the split in the wire so it's normally closed (NC). Wick off the solder to open the connection. Reapply solder to reclose the connection.
L1-L3 = EagleLibrary_Wuerth_Elektronik_eiSos_rev16a:WE-CBA: WE-CBA SMD EMI Suppression Ferrite Bead Characteristics Reliable Ni-Sn electrodes High rated current up to 5A Recommended soldering: Reflow Operating temperature: -55°C to +125°C Applications * Perfect as data line filter and for uncoupling of distribution voltage *This special SMD chip bead ferrites can be put directly on the printed circuit board. They offer excellent anti-EMI properties and low DC-resistance. Placed very close next to the interference source even with smallest size 0402,maximal impedance at 1000 Ω can be reached. *High Speed: "High Speed " SMD ferrites WE-CBF have lower impedance in the lower frequency ranges thus they have only a low attenuation for fast signals. Application e.g. USB 2.0, IEEE 1394,LVDS *Wide Band: "Wide Band" SMD ferrites WE-CBF already show high impedance in low frequency range. Therefore they are wide band through the whole spectrum. Application e.g. control signats, RS232, RS422, DC/DC converter *High Current: "High Current " SMD ferrites WE-CBF are designed for high current (over 1 A). The rated current refers to 40K self-heating. High current SMD ferrites are available in all there types (High Speed, Wide Band and High Frequency). Application e.g. power supply, DC/DC converter *Advice: Pay attention for the use of SMD-Ferrites for high current>1A and ambient temperature over +85°C that the rated current has to be reduced when temperature is above +85°C (Derating). *At+100°C environment temperature the maximal rated current has to add up to only 60% of the data sheet value ,without an overload of the component. Variant abbreviation WB means WIDE BAND HS means HIGH SPEED HC means HIGH CURRENT <http://katalog.we-online.de/media/images/eisos/FeCBA_pf2.jpg> Details see: http://katalog.we-online.de/en/pbs/WE-CBA/ Created: 2015-02-02 2015 (C) Wurth Elektronik
LED1 = led:LED: LED OSRAM: - CHIPLED LG R971, LG N971, LY N971, LG Q971, LY Q971, LO R971, LY R971 LH N974, LH R974 LS Q976, LO Q976, LY Q976 LO Q996 - Hyper CHIPLED LW Q18S LB Q993, LB Q99A, LB R99A - SideLED LS A670, LO A670, LY A670, LG A670, LP A670 LB A673, LV A673, LT A673, LW A673 LH A674 LY A675 LS A676, LA A676, LO A676, LY A676, LW A676 LS A679, LY A679, LG A679 - Hyper Micro SIDELED® LS Y876, LA Y876, LO Y876, LY Y876 LT Y87S - SmartLED LW L88C, LW L88S LB L89C, LB L89S, LG L890 LS L89K, LO L89K, LY L89K LS L896, LA L896, LO L896, LY L896 - TOPLED LS T670, LO T670, LY T670, LG T670, LP T670 LSG T670, LSP T670, LSY T670, LOP T670, LYG T670 LG T671, LOG T671, LSG T671 LB T673, LV T673, LT T673, LW T673 LH T674 LS T676, LA T676, LO T676, LY T676, LB T676, LH T676, LSB T676, LW T676 LB T67C, LV T67C, LT T67C, LS T67K, LO T67K, LY T67K, LW E67C LS E67B, LA E67B, LO E67B, LY E67B, LB E67C, LV E67C, LT E67C LW T67C LS T679, LY T679, LG T679 LS T770, LO T770, LY T770, LG T770, LP T770 LB T773, LV T773, LT T773, LW T773 LH T774 LS E675, LA E675, LY E675, LS T675 LS T776, LA T776, LO T776, LY T776, LB T776 LHGB T686 LT T68C, LB T68C - Hyper Mini TOPLED® LB M676 - Mini TOPLED Santana® LG M470 LS M47K, LO M47K, LY M47K Source: http://www.osram.convergy.de LUXEON: - LUMILED® LXK2-PW12-R00, LXK2-PW12-S00, LXK2-PW14-U00, LXK2-PW14-V00 LXK2-PM12-R00, LXK2-PM12-S00, LXK2-PM14-U00 LXK2-PE12-Q00, LXK2-PE12-R00, LXK2-PE12-S00, LXK2-PE14-T00, LXK2-PE14-U00 LXK2-PB12-K00, LXK2-PB12-L00, LXK2-PB12-M00, LXK2-PB14-N00, LXK2-PB14-P00, LXK2-PB14-Q00 LXK2-PR12-L00, LXK2-PR12-M00, LXK2-PR14-Q00, LXK2-PR14-R00 LXK2-PD12-Q00, LXK2-PD12-R00, LXK2-PD12-S00 LXK2-PH12-R00, LXK2-PH12-S00 LXK2-PL12-P00, LXK2-PL12-Q00, LXK2-PL12-R00 Source: www.luxeon.com KINGBRIGHT: KA-3528ASYC Source: www.kingbright.com
Q8 = Simplex-DiscreteSemi:MOSFET-NCHANNEL: Generic N-channel mosfet
R1 R3-R21 R23 R24 = rcl:R-EU_: RESISTOR, European symbol
R2 = resistor-array:CAY16A-2002F4LF: Resistor Networks & Arrays 20K 1% CONVEX SQUARE 4X0603 Source: Datasheet <https://www.bourns.com/docs/product-datasheets/cay16a-lf.pdf?sfvrsn=fc8c48f6_4>; DESCRIPTION: Resistor Networks & Arrays 20K 1% CONVEX SQUARE 4X0603; HEIGHT: 0.6mm; MANUFACTURER_NAME: Bourns; MANUFACTURER_PART_NUMBER: CAY16A-2002F4LF; MOUSER_PART_NUMBER: 652-CAY16A-2002F4LF; MOUSER_PRICE-STOCK: https://www.mouser.co.uk/ProductDetail/Bourns/CAY16A-2002F4LF?qs=DRkmTr78QARfyqk9aCUmrA%3D%3D
TP1-TP6 = testpad:TP: Test pad
U1 = SparkFun-IC-Microcontroller:ATMEGA328P_TQFP: Popular 328P in QFP Storefront component: ATmega328 - TQFP <https://www.sparkfun.com/products/13448> (COM-13448) Datasheet <http://www.sparkfun.com/datasheets/Components/SMD/ATMega328.pdf> SparkFun Products SparkFun RedBoard - Programmed with Arduino <https://www.sparkfun.com/products/12757> (DEV-12757) Arduino Pro Mini 328 - 5V/16MHz <https://www.sparkfun.com/products/11113> (DEV-11113) Arduino Pro Mini 328 - 3.3V/8MHz <https://www.sparkfun.com/products/11114> (DEV-11114) SparkFun OpenLog <https://www.sparkfun.com/products/13712> (DEV-13712) SparkFun MicroView - OLED Arduino Module <https://www.sparkfun.com/products/12923> (DEV-12923) SparkFun Digital Sandbox <https://www.sparkfun.com/products/12651> (DEV-12651) SparkFun PicoBoard <https://www.sparkfun.com/products/11888> (WIG-11888) Arduino Fio <https://www.sparkfun.com/products/10116> (DEV-10116) LilyPad Arduino 328 Main Board <https://www.sparkfun.com/products/13342> (DEV-13342) SparkFun RedStick <https://www.sparkfun.com/products/13741> (DEV-13741) LilyPad MP3 <https://www.sparkfun.com/products/11013> (DEV-11013) LilyPad Arduino SimpleSnap <https://www.sparkfun.com/products/10941> (DEV-10941) SparkFun Stepoko <https://www.sparkfun.com/products/13899> (ROB-13899) SparkFun Geiger Counter <https://www.sparkfun.com/products/11345> (SEN-11345) SparkFun EL Sequencer <https://www.sparkfun.com/products/12781> (COM-12781) Arduino Pro 328 - 5V/16MHz <https://www.sparkfun.com/products/10915> (DEV-10915) CryptoCape <https://www.sparkfun.com/products/12773> (DEV-12773) SparkFun IR Thermometer Evaluation Board - MLX90614 <https://www.sparkfun.com/products/10740> (SEN-10740) SparkFun RedBot Mainboard <https://www.sparkfun.com/products/12097> (ROB-12097) Arduino Pro 328 - 3.3V/8MHz <https://www.sparkfun.com/products/10914> (DEV-10914) SparkFun Block for Intel® Edison - Arduino <https://www.sparkfun.com/products/13036> (DEV-13036) SparkFun Simon Says - Surface Mount Soldering Kit <https://www.sparkfun.com/products/10935> (KIT-10935) SparkFun 7-Segment Serial Display - Red <https://www.sparkfun.com/products/11441> (COM-11441) SparkFun 7-Segment Serial Display - White <https://www.sparkfun.com/products/11629> (COM-11629) SparkFun 7-Segment Serial Display - Yellow <https://www.sparkfun.com/products/11443> (COM-11443) SparkFun 7-Segment Serial Display - Kelly Green <https://www.sparkfun.com/products/11440> (COM-11440) SparkFun 7-Segment Serial Display - Blue <https://www.sparkfun.com/products/11442> (COM-11442) SparkFun OpenSegment Serial Display - 20mm (Blue) <https://www.sparkfun.com/products/11647> (COM-11647) SparkFun OpenSegment Serial Display - 20mm (Green) <https://www.sparkfun.com/products/11646> (COM-11646) SparkFun OpenSegment Serial Display - 20mm (White) <https://www.sparkfun.com/products/11648> (COM-11648) SparkFun OpenSegment Serial Display - 20mm (Red) <https://www.sparkfun.com/products/11644> (COM-11644) SparkFun OpenSegment Serial Display - 20mm (Yellow) <https://www.sparkfun.com/products/11645> (COM-11645) SparkFun OpenSegment Shield <https://www.sparkfun.com/products/13190> (DEV-13190); PROD_ID: IC-09069
Y1 = crystal:ABM8-12.000MHZ-12-B1U-T: CERAMIC SMD CRYSTAL Source: Datasheet <https://abracon.com/Resonators/abm8.pdf>; DESCRIPTION: CERAMIC SMD CRYSTAL; HEIGHT: 0.8mm; MANUFACTURER_NAME: ABRACON; MANUFACTURER_PART_NUMBER: ABM8-12.000MHZ-12-B1U-T; MOUSER_PART_NUMBER: 815-M812000MHZ12B1UT; MOUSER_PRICE-STOCK: https://www.mouser.co.uk/ProductDetail/ABRACON/ABM8-12.000MHZ-12-B1U-T?qs=vLWxofP3U2wqlTvBlimfnA%3D%3D

## Board
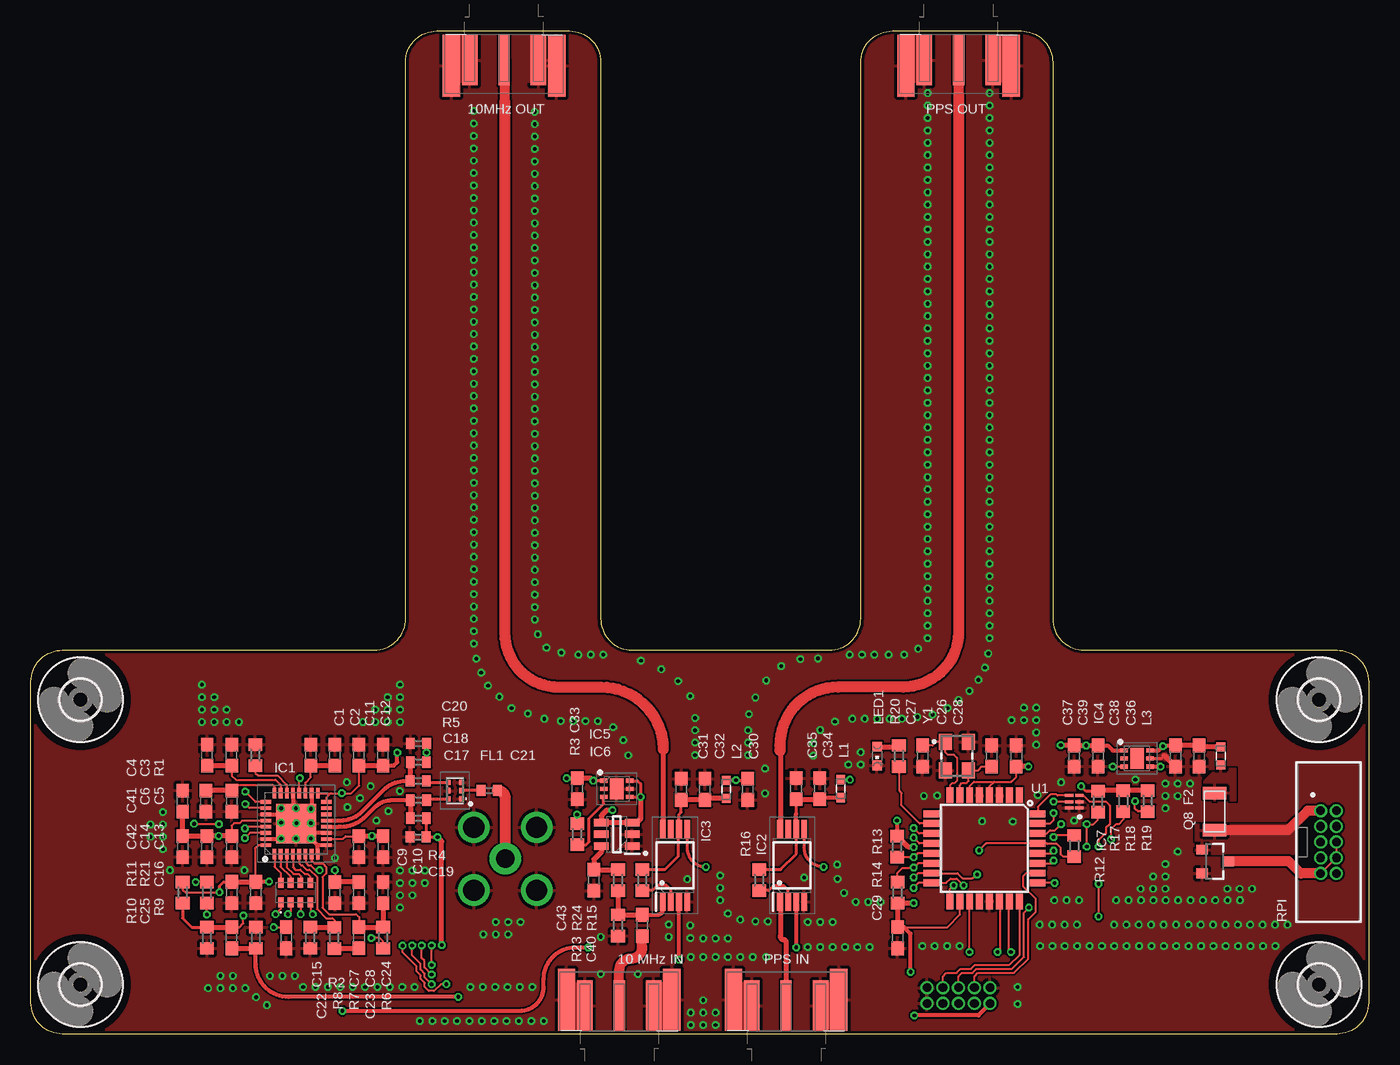
[diagram p7: board, top side]
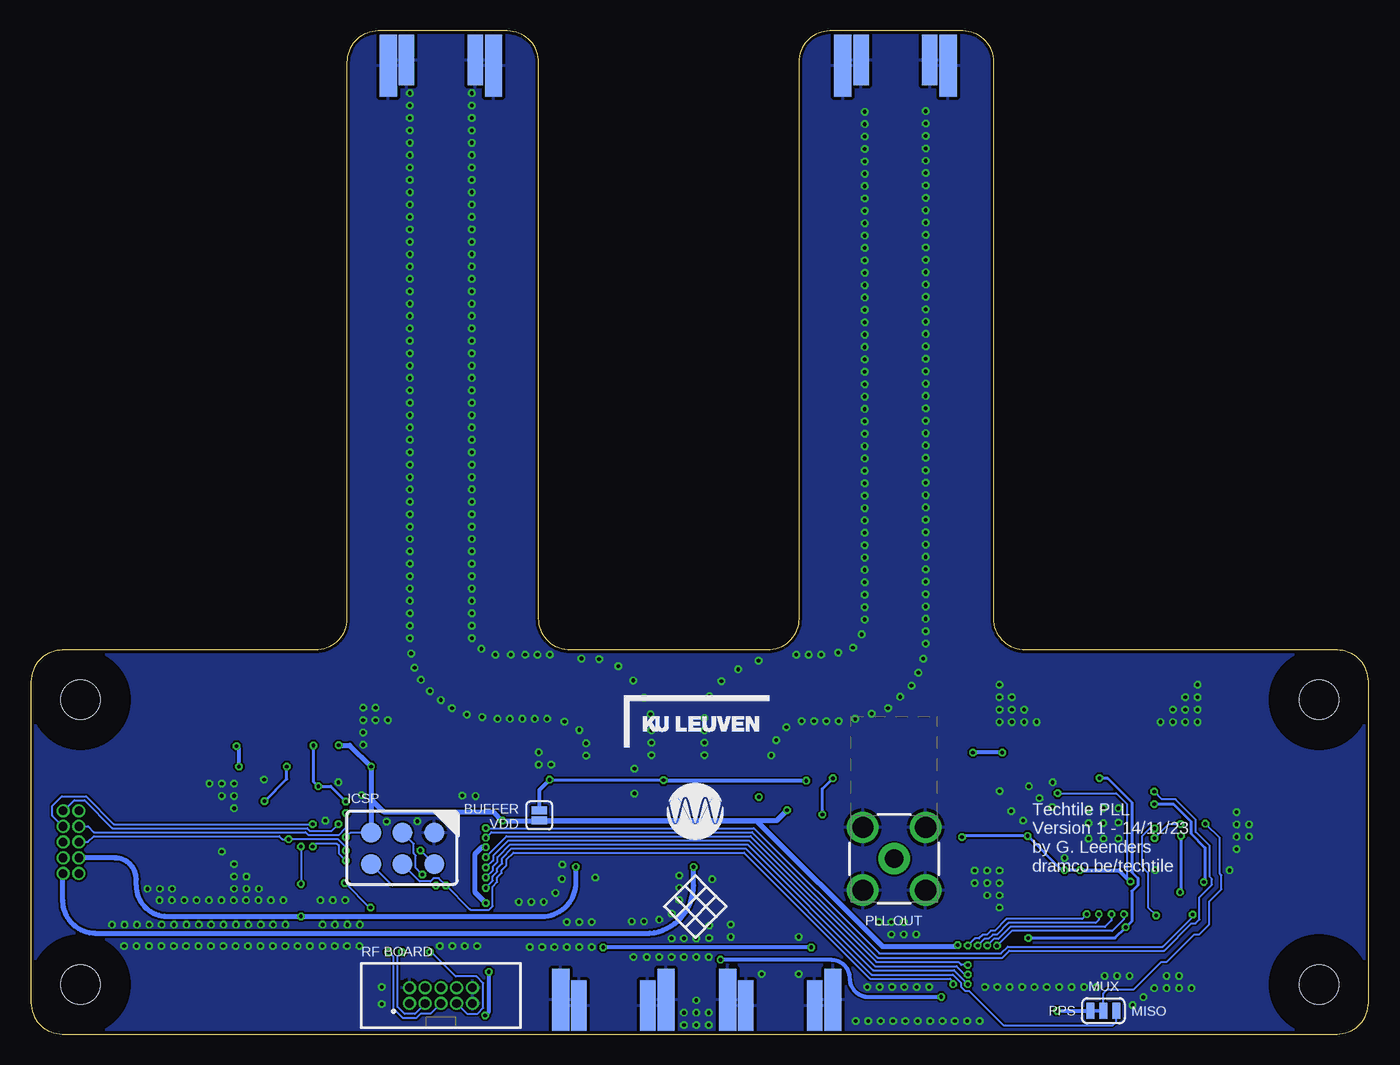
[diagram p8: board, bottom side, seen from below]

Size 108 x 81 mm. Coordinates in mm from the lower left corner, seen from the top.
Outline: 30.25,78.5 arc-90 32.75,81 43.5,81 arc-90 46,78.5 46,33.54 arc90 48.54,31 64.46,31 arc90 67,33.54 67,78.46 arc-90 69.54,81 79.96,81 arc-90 82.5,78.46 82.5,33.54 arc90 85.04,31 105.46,31 arc-90 108,28.46 108,2.54 arc-90 105.46,0 2.54,0 arc-90 0,2.54 0,28.46 arc-90 2.54,31 27.71,31 arc90 30.25,33.54 30.25,78.5
Copper layers (1*16): Top 0.035mm / dielectric 1.5mm / Bottom 0.035mm
Design rules "SeeedStudio_2layer_DRU_no_angle_20140221 *": minimum track width 6mil, minimum drill 0.3mm, track to track 6mil, track to pad 6mil, pad to pad 6mil, via to via 6mil, smd to smd 0mil, copper to edge 10mil, drill to drill 10mil, minimum pad ring 1mil, minimum via ring 6mil, stop-mask expansion 2mil, vias tented up to drill 100mil, thermal gap 10mil

### Footprints (pad centres in the part's own frame; a part is rotated, then mirrored left to right if it is on the bottom)
C0603 = smd 1.1 x 1: 1 -0.85,0; 2 0.85,0
C0402 = smd 0.7 x 0.9: 1 -0.65,0; 2 0.65,0
1206 = smd 1 x 1.9: P$1 -1.5,0; P$2 1.5,0
B0430J50100AHF = smd 0.41 x 0.33: 1 -0.66,-0.495; 2 0,-0.495; 3 0.66,-0.495; 4 0.66,0.495; 5 0,0.495; 6 -0.66,0.495
3,2 = hole 3.2: 0,0
QFN50P500X500X80-33N = smd 0.85 x 0.3: 1 -2.45,1.75; 2 -2.45,1.25; 3 -2.45,0.75; 4 -2.45,0.25; 5 -2.45,-0.25; 6 -2.45,-0.75; 7 -2.45,-1.25; 8 -2.45,-1.75; 17 2.45,-1.75; 18 2.45,-1.25; 19 2.45,-0.75; 20 2.45,-0.25; 21 2.45,0.25; 22 2.45,0.75; 23 2.45,1.25; 24 2.45,1.75 | smd 0.3 x 0.85: 9 -1.75,-2.45; 10 -1.25,-2.45; 11 -0.75,-2.45; 12 -0.25,-2.45; 13 0.25,-2.45; 14 0.75,-2.45; 15 1.25,-2.45; 16 1.75,-2.45; 25 1.75,2.45; 26 1.25,2.45; 27 0.75,2.45; 28 0.25,2.45; 29 -0.25,2.45; 30 -0.75,2.45; 31 -1.25,2.45; 32 -1.75,2.45 | smd 3.2 x 3.2: 33 0,0
SOP65P640X120-8N = smd 1.475 x 0.45: 1 -2.938,0.975; 2 -2.938,0.325; 3 -2.938,-0.325; 4 -2.938,-0.975; 5 2.938,-0.975; 6 2.938,-0.325; 7 2.938,0.325; 8 2.938,0.975
SON65P200X200X80-7N = smd 0.6 x 0.35: 1 -1.05,0.65; 2 -1.05,0; 3 -1.05,-0.65; 4 1.05,-0.65; 5 1.05,0; 6 1.05,0.65 | smd 1.1 x 1.7: 7 0,0
SOT95P280X145-6N = smd 1.2 x 0.6: 1 -1.25,0.95; 2 -1.25,0; 3 -1.25,-0.95; 4 1.25,-0.95; 5 1.25,0; 6 1.25,0.95
SON50P100X145X60-6N = smd 0.66 x 0.254: 1 -0.406,0.508; 2 -0.406,0; 3 -0.406,-0.508; 4 0.406,-0.508; 5 0.406,0; 6 0.406,0.508
60312202111527 = smd 0.9 x 4.1: 1 0,0 | smd 1.25 x 4.1: 2 -2.775,0; 3 2.775,0 | smd 1.25 x 4.1 bottom: 4 -2.775,0; 5 2.775,0 | smd 1.4 x 5: 7 -4.25,0.468; 8 4.25,0.468 | smd 1.4 x 5 bottom: 9 -4.25,0.468; 10 4.25,0.468
62701021621 = drill 0.7 pad 1.05: 1 -2.54,-0.635; 2 -2.54,0.635; 3 -1.27,-0.635; 4 -1.27,0.635; 5 0,-0.635; 6 0,0.635; 7 1.27,-0.635; 8 1.27,0.635; 9 2.54,-0.635; 10 2.54,0.635
60311002114501 = drill 1.5 pad 2.54: 1 0,0 | drill 1.7 pad 2.54: 2 -2.54,2.54; 3 2.54,2.54; 4 2.54,-2.54; 5 -2.54,-2.54
SMT-JUMPER_3_1-NC_TRACE_SILK = smd 0.66 x 1.27: 1 -1.041,0; 2 0,0; 3 1.041,0
SMT-JUMPER_2_NC_PASTE_SILK = smd 0.635 x 1.27: 1 -0.406,0; 2 0.406,0
WE-CBA_0603(W=2.2) = smd 0.75 x 0.7: 1 -0.725,0; 2 0.725,0
CHIPLED_0603 = smd 0.8 x 0.8: A 0,-0.75; C 0,0.75
SOT23-3 = smd 0.8 x 0.9: 1 -0.95,-1; 2 0.95,-1; 3 0,1.1
R0603 = smd 1 x 1.1: 1 -0.85,0; 2 0.85,0
CAY16A1003F4LF = smd 0.45 x 0.8: 1 -1.2,-0.8; 2 -0.4,-0.8; 3 0.4,-0.8; 4 1.2,-0.8; 5 1.2,0.8; 6 0.4,0.8; 7 -0.4,0.8; 8 -1.2,0.8
R0402 = smd 0.7 x 0.9: 1 -0.65,0; 2 0.65,0
TP16R = smd 1.6 x 1.6: TP 0,0
TQFP32-08 = smd 1.27 x 0.559: 1 -4.293,2.8; 2 -4.293,2; 3 -4.293,1.2; 4 -4.293,0.4; 5 -4.293,-0.4; 6 -4.293,-1.2; 7 -4.293,-2; 8 -4.293,-2.8; 17 4.293,-2.8; 18 4.293,-2; 19 4.293,-1.2; 20 4.293,-0.4; 21 4.293,0.4; 22 4.293,1.2; 23 4.293,2; 24 4.293,2.8 | smd 0.559 x 1.27: 9 -2.8,-4.293; 10 -2,-4.293; 11 -1.2,-4.293; 12 -0.4,-4.293; 13 0.4,-4.293; 14 1.2,-4.293; 15 2,-4.293; 16 2.8,-4.293; 25 2.8,4.293; 26 2,4.293; 27 1.2,4.293; 28 0.4,4.293; 29 -0.4,4.293; 30 -1.2,4.293; 31 -2,4.293; 32 -2.8,4.293
ABM810000MHZ12D2W = smd 1.3 x 1.05: 1 -1.15,-0.925; 2 1.15,-0.925; 3 1.15,0.925; 4 -1.15,0.925

### Placement (x,y rotation side)
C1  22.6,22.52 90 top
C2  24.55,22.52 90 top
C3  16.21,22.52 90 top
C4  14.23,22.52 90 top
C5  16.21,18.81 270 top
C6  14.14,18.81 270 top
C7  24.55,11.43 270 top
C8  26.49,11.43 270 top
C9  26.49,15.15 270 top
C10  28.43,15.13 270 top
C11  26.49,22.52 90 top
C12  28.43,22.52 90 top
C13  16.21,15.15 270 top
C14  14.21,15.15 270 top
C15  18.17,11.43 270 top
C16  16.21,11.43 270 top
C17  31.29,18.89 0 top
C18  31.27,20.44 0 top
C19  31.26,15.91 0 top
C20  31.29,23.47 0 top
C21  37,19.67 0 top
C22  20.6,7.77 270 top
C23  26.49,7.79 270 top
C24  28.43,11.43 90 top
C25  16.21,7.77 90 top
C26  77.57,22.45 270 top
C27  71.99,22.45 90 top
C28  79.56,22.45 270 top
C29  69.97,7.77 90 top
C30  57.86,19.76 270 top
C31  52.51,19.76 90 top
C32  54.42,19.76 90 top
C33  44.1,19.81 270 top
C34  63.7,19.81 90 top
C35  61.77,19.81 90 top
C36  94.32,22.45 270 top
C37  84.23,22.45 270 top
C38  92.42,22.45 270 top
C39  86.16,22.45 270 top
C40  49.35,8.77 90 top
C41  12.25,18.81 90 top
C42  12.25,15.15 270 top
C43  45.45,12.43 270 top
F2  95.57,17.95 90 top
FL1  34.23,19.66 90 top
H1  4,27 0 top
H2  4,4 0 top
H3  104,27 0 top
H4  104,4 0 top
IC1  21.41,16.99 90 top
IC2  61.45,13.62 90 top
IC3  52,13.62 90 top
IC4  89.3,22.26 0 top
IC5  47.3,19.8 0 top
IC6  47.3,16.13 180 top
IC7  84.23,18.76 180 top
J1  74.9,78.65 180 top
J2  38.2,78.65 180 top
J3  104.77,15.5 270 top
J4  74.9,3.11 0 bottom
J5  38.3,14.15 90 bottom
J6  60.98,2.3 0 top
J7  47.5,2.3 0 top
JP1  21.41,1.87 180 bottom
JP2  66.95,17.65 90 bottom
L1  65.39,19.81 270 top
L2  56.15,19.76 270 top
L3  96.07,22.45 90 top
LED1  68.33,22.45 180 top
Q8  95.56,13.94 270 top
R1  18.12,22.52 90 top
R2  21.37,11.43 0 top
R3  44.1,16.13 90 top
R4  31.29,17.43 180 top
R5  31.29,21.95 180 top
R6  28.43,7.77 90 top
R7  24.49,7.77 270 top
R8  22.55,7.77 90 top
R9  18.17,7.77 270 top
R10  14.21,7.77 90 top
R11  12.25,11.43 90 top
R12  84.23,15.19 90 top
R13  69.93,15.15 90 top
R14  69.97,11.43 270 top
R15  49.35,12.43 90 top
R16  58.8,12.43 90 top
R17  86.16,18.76 90 top
R18  88.19,18.81 90 top
R19  90.16,18.82 90 top
R20  70.08,22.45 270 top
R21  14.21,11.43 90 top
R23  47.4,8.77 90 top
R24  47.4,12.43 90 top
TP1  80.53,13.72 0 bottom
TP2  78,13.72 0 bottom
TP3  75.44,13.72 0 bottom
TP4  80.53,16.27 0 bottom
TP5  78,16.27 0 bottom
TP6  75.44,16.27 0 bottom
U1  77,14.99 270 top
Y1  74.78,22.45 270 top

### Tracks (layer width: path | path; a pad name or v marks a point on that pad's centre or on a via)
5VIN
  Top 0.813: J3.1 103.09,18.04 101.5,16.45 F2.P$1
  pour Top: 94,16.9 94,14.55 102,14.55 102,16.9
10MHZ_IN
  Top 0.813: J7.1 47.5,5.18 arc-90 48.5,6.1 arc90 49.35,7.03 C40.1
10MHZ_PLL  (via drill 0.3)
  Top 0.254: IC3.3 52.33,10.18 | 18.15,6.91 arc-90 R9.2
  Top 0.305: v34.5,3 20.77,3 arc-90 18.15,5.62 18.15,6.91 | 52.33,10.18 52.33,9.07 52.33,8.55 v52.33,6
  Top 0.406: C25.1 R9.2
  Bottom 0.305: v34.5,3 40.38,3 arc90 41.9,4.5 arc-90 43.4,6 v52.33,6
10MHZ_RPI  (via drill 0.3)
  Top 0.254: IC3.5 52.98,15.02 arc90 v54.5,13.5
  Bottom 0.406: J3.10 arc-90 105.42,12.94 105.42,10.77 arc-90 102.78,8.12 58.38,8.12 arc-90 54.5,12 v54.5,13.5
10MHZ_USRP
  Top 0.406: 51.05,23 51.05,16.58 arc-90 IC3.8
  Top 0.813: J2.1 arc-90 38.25,78.6 38.25,75.33
  Top 0.892: 38.25,75.33 38.25,32.38 arc90 42.6,28.02 46.02,28.02 arc-90 51.05,23
+3V3  (via drill 0.3)
  Top 0.152: IC1.32 18.37,15.24 18.1,14.98 18.1,12.36 C15.1 | IC1.28 18.57,17.24 18.55,17.23 17.05,17.23 16.85,17.02 16.4,17.02 16.2,16.83 C13.1 | IC1.6 22.16,13.87 22.4,13.62 22.6,13.62 23,13.23 v23.3,13.23 | v24.55,13.23 C7.1 | IC1.10 25.17,15.74 25.4,15.98 26.47,15.98 C9.1 | IC1.17 24.2,19.45 | 24.2,19.45 25.87,19.45 26.5,20.08 C11.1 | 24.2,19.45 23.86,19.1 IC1.16 23.86,19.11 24.2,19.45 v25.1,19.45 | U1.6 75.8,20.02 76.15,20.38 77.78,20.38 | 77.78,20.38 79.15,20.38 79.55,20.77 C28.2 | U1.4 77.39,19.99 77.78,20.38 | R12.2 82.72,16.04 v82.58,15.9 | R19.2 87.22,19.67 87.2,19.65 | C29.2 70.5,8.62 74,8.62 75.03,9.65 75.03,10.67 U1.18 | R11.2 12.25,11.65 12.47,11.43 15.2,11.43 v15.22,11.45 | IC7.5 v82.59,18.76 v82.58,18.77
  Top 0.254: 31.91,17.37 C19.2 v32.81,15.91 v32.83,15.9 | v15.22,11.45 15.22,11.95 15.55,12.27 16.2,12.27 C16.1 | IC5.4 v49.23,19.15 49.23,20.2 48.98,20.45 IC5.6 | R17.2 85.19,19.61 v84.8,20
  Top 0.305: v19.23,12.3 18.19,12.3 C15.1 | C13.1 | C39.1 86.94,23.3 87.35,22.9 IC4.1 | J4.1 77.44,2.44 76.5,1.5 v71.33,1.5 | v69.92,17.23 R13.2 | C12.1 29.3,21.67 29.57,21.95 v29.57,22.73 | v31.94,22.73 R5.1 | v71.03,5.02 71.03,8.1 70.5,8.62
  Top 0.406: C16.1 C15.1 | C13.1 v15.15,15.99 C14.1 13.2,15.99 | C11.1 C12.1 | C9.1 v27.52,15.99 28.42,15.99 C10.1 | C8.1 C7.1 | R4.1 arc45 31.91,17.37 | R5.1 arc45 31.94,21.97 v31.94,22.73 C20.2 | R19.2 R18.2 86.19,19.66 R17.2 | C39.1 v85.2,23.3 C37.1 83.17,23.3 v83.15,23.33 | v80.53,21.6 C28.2 | C29.2 R14.2 70.56,10.59 v71.28,10.57 | v71.28,15.08 70.85,15.08 R13.2 | v33.17,7.18 33.17,15.55 v32.83,15.9 | 69.95,17.25 v69.92,17.23 | 13.2,15.99 C42.1 C41.1 | 13.2,15.99 13.2,16 | v49.23,19.15 49.25,19.12 49.25,17.4 48.94,17.09 IC6.3 IC6.4 46.05,17.65 46.48,18.08 v46.95,18.08
  Bottom 0.152: v82.58,15.9 82.2,16.27 80.55,16.27 TP4.TP | v25.1,19.45 20.38,19.45 19.5,18.58 19.5,12.57 v19.23,12.3
  Bottom 0.254: v23.3,13.23 v24.55,13.23 24.75,13.23 v27.52,15.99 27.55,16.02 32.7,16.02 v32.83,15.9 | v15.15,15.99 15.15,11.52 v15.22,11.45 | 69.91,17.24 v69.92,17.23 | v85.2,23.3 85.2,20.4 v84.8,20 83.8,20 v82.58,18.77
  Bottom 0.305: v23.3,13.23 20.15,13.23 v19.23,12.3 | v71.33,1.5 71.03,1.8 v71.03,5.02 | v29.57,22.73 v31.94,22.73
  Bottom 0.406: 80.53,18.95 v80.53,21.6 82.26,23.33 v83.15,23.33 | 80.53,18.95 TP4.TP | 80.53,18.95 79.48,17.9 70.62,17.9 69.95,17.23 v69.92,17.23 49.4,17.23 | v71.28,10.57 72.12,11.43 72.12,14.55 71.6,15.08 v71.28,15.08 | v33.17,7.18 33.38,7.07 39.25,7.07 49.4,17.23 | JP2.1 49.42,17.24 | 49.42,17.24 49.4,17.23 | 49.42,17.24 47.78,17.24 v46.95,18.08
+5V
  pour Top: 95.65,21.35 94.75,20.4 94.75,18.9 97.25,18.9 97.25,21.4
A0  (via drill 0.3)
  Top 0.152: v79.12,6.62 78.97,6.77 78.97,10.68 U1.23
  Bottom 0.152: J4.5 75.72,1.65 76.53,1.65 76.9,1.27 77.95,1.27 78.72,2.05 78.72,6.23 v79.12,6.62
A1
  Top 0.152: J4.8 73.63,4.63 73.92,4.93 74.72,4.93 75.05,5.25 75.9,5.25 76.22,5.57 79,5.57 79.8,6.37 U1.24
A2  (via drill 0.3)
  Top 0.152: J4.6 74.9,4.65 75.17,4.93 76.03,4.93 76.35,5.25 79.2,5.25 80.17,6.23 80.17,9.8 v80.58,10.2 | v82.65,12.2 U1.25
  Bottom 0.152: v80.58,10.2 80.65,10.2 v82.65,12.2
A3
  Top 0.152: J4.4 76.17,4.62 76.47,4.93 79.38,4.93 80.53,6.07 80.53,9.27 81.12,9.88 81.12,10.9 80.15,11.88 80.15,12.77 80.38,13 U1.26
A6  (via drill 0.3)
  Top 0.152: v75.78,6.62 75.78,10.68 U1.19
  Bottom 0.152: J4.7 72.78,1.62 71.95,1.62 71.47,2.1 71.47,4.1 72.03,4.65 73.7,4.65 75.78,6.73 v75.78,6.62
A7  (via drill 0.3)
  Top 0.152: U1.22 78.22,10.67 78.22,6.8 v78.05,6.62
  Bottom 0.152: J4.3 76.17,2.45 77,1.62 77.83,1.62 78.4,2.2 78.4,6.27 v78.05,6.62
CE  (via drill 0.3)
  Top 0.152: R2.4 22.57,9.86 v22.75,9.68 | U1.13 71.59,14.59 v71.28,14.27 71.27,14.3 R13.1 | v32.35,5.57 v32.35,7.15
  Bottom 0.152: v71.28,14.27 69.6,15.98 49.9,15.98 39.75,5.82 33.12,5.82 32.88,5.57 v32.35,5.57 | v22.75,9.68 23.12,9.3 29.23,9.3 30.18,8.35 30.5,8.35 30.82,8.02 31.15,8.02 31.45,7.73 31.77,7.73 v32.35,7.15
CLK  (via drill 0.3)
  Top 0.152: R2.1 20.17,10.09 v19.75,9.68 | U1.17 74.19,11.7 v74.5,12 | v30,7.12 30,6.6 31.12,5.48 31.12,5.07 31.48,4.73 31.48,4.45 31.8,4.12 31.8,3.8 32.12,3.48 32.55,3.48 33.1,4.02 v33.55,4.02
  Bottom 0.152: v19.75,9.68 19.75,9.27 20.7,8.32 28.8,8.32 v30,7.12 | TP2.TP 76.61,12.32 75.75,12.32 75.5,12.57 75.08,12.57 v74.5,12 72.58,10.07 72.55,10.07 72.5,10.02 71.03,10.02 70.72,10.32 70.72,11.9 70.35,12.27 70.35,12.65 70,13 70,13.23 69.6,13.62 69.6,14.1 69.05,14.65 50.42,14.65 40.25,4.48 33.8,4.48 33.55,4.23 v33.55,4.02
CP
  Top 0.152: IC1.7 22.66,14.02 22.9,13.77 23.55,13.77 23.85,13.48 23.85,12.98 23.55,12.68 23.55,10.2 24.07,9.68 26.25,9.68 26.5,9.43 C23.1
  Top 0.406: C23.1 28.42,8.64 R6.2 C24.1
D0  (via drill 0.3)
  Top 0.152: U1.30 82.02,16.2 82.28,16.45 82.67,16.45 v83.17,16.95
  Bottom 0.152: J3.2 105.33,18.04 104.5,18.88 103.67,18.88 101.42,16.62 85.7,16.62 85.45,16.38 83.75,16.38 v83.17,16.95
D1  (via drill 0.3)
  Top 0.152: U1.31 82.3,16.99 82.58,17.27 v82.58,17.85
  Bottom 0.152: J3.3 103.39,16.77 102.92,16.3 85.83,16.3 85.58,16.05 83.17,16.05 82.58,16.65 v82.58,17.85
D2
  Top 0.152: U1.32 81.3,17.81 81.3,18.33 82.33,19.35 82.8,19.35 82.88,19.27 IC7.4
D6
  Top 0.152: U1.10 71.75,16.99 70.3,18.45 70.3,19.45 70.08,19.66 R20.2
GND  (via drill 0.3)
  Top 0.254: 22.25,16.12 21.38,17 | 23.16,15.22 23.13,15.24 | IC4.5 91.25,22.26 91.5,22.5
  Top 0.305: IC1.27 20.66,17.74 IC1.33 | IC1.9 23.13,15.24 22.25,16.12 | IC1.8 23.16,15.22 | IC1.21 21.16,17.24 IC1.33 | IC1.11 22.16,16.24 IC1.33 | IC1.31 20.17,15.74 v20.2,15.77 | IC1.18 22.66,18.23 v22.6,18.17 | J7.2 44.73,1.77 45,1.5
  Top 0.406: C38.2 92.39,21.6 91.5,22.5
  other vias: 21.4,15.77 22.6,15.77 20.2,17.08 22.6,17.02 20.2,18.23 21.4,18.23 24.55,14.23 21.43,17.02 25.55,18.33 26.57,19.05 27.43,20 29.77,19.62 27.9,17.23 28.85,18 25.5,20.33 76.8,17.17 79.28,17.15 81.17,23.35 79.67,3.8 79.67,2.43 73.17,19.25 81.3,19.3 16.3,4.7 17.23,13.23 11.22,13.23 10.65,17.92 19.3,4.7 15.3,4.7 20.3,4.7 21.3,4.7 16.3,3.7 15.3,3.7 14.3,3.7 31.4,1.05 32.4,1.05 33.4,1.05 34.4,1.05 35.4,1.05 36.4,1.05 37.4,1.05 38.4,1.05 39.4,1.05 35.48,3.8 36.48,3.8 37.48,3.8 38.48,3.8 39.48,3.8 40.48,3.8 40.4,1.05 41.4,1.05 30.98,3.8 29.98,3.8 28.98,3.8 27.98,3.8 26.98,3.8 25.98,3.8 24.98,3.8 23.98,3.8 22.98,3.8 21.98,3.8 17.3,3.7 18.18,2.98 19.05,2.32 65.65,11.4 65.12,12.52 71.97,7.1 72.97,7.1 73.97,7.1 74.97,7.1 81.47,7.1 82.47,7.1 83.47,7.1 84.47,7.1 85.47,7.1 86.47,7.1 87.47,7.1 88.47,7.1 89.47,7.1 90.47,7.1 91.47,7.1 92.47,7.1 93.47,7.1 94.47,7.1 95.47,7.1 82.62,10.8 83.62,10.8 84.62,10.8 88.62,10.8 89.62,10.8 90.62,10.8 91.62,10.8 96.62,10.8 97.62,10.8 77.4,46.97 77.4,47.97 77.4,48.97 77.4,49.97 77.4,50.97 77.4,51.97 77.4,52.97 77.4,53.97 77.4,54.97 77.4,55.97 77.4,56.97 77.4,57.97 77.4,58.97 77.4,59.97 77.4,60.97 77.4,61.97 77.4,62.97 77.4,63.97 77.4,64.97 77.4,65.97 77.4,66.97 77.4,67.97 77.4,68.97 77.4,69.97 77.4,70.97 77.4,71.97 77.4,72.97 77.4,73.97 77.4,74.97 77.4,75.97 40.67,45.47 40.67,46.47 40.67,47.47 40.67,48.47 40.67,49.47 40.67,50.47 40.67,51.47 40.67,52.47 40.67,53.47 40.67,54.47 40.67,55.47 40.67,56.47 40.67,57.47 40.67,58.47 40.67,59.47 40.67,60.47 40.67,61.47 40.67,62.47 40.67,63.47 40.67,64.47 40.67,65.47 40.67,66.47 40.67,67.47 40.67,68.47 40.67,69.47 40.67,70.47 40.67,71.47 40.67,72.47 40.67,73.47 40.67,74.47 40.67,33.48 40.67,34.48 40.67,35.48 40.67,36.48 40.67,37.48 40.67,38.48 40.67,39.48 40.67,40.48 40.67,41.48 40.67,42.48 40.67,43.48 40.67,44.48 77.4,31.98 77.4,32.98 77.4,33.98 77.4,34.98 77.4,35.98 77.4,36.98 77.4,37.98 77.4,38.98 77.4,39.98 77.4,40.98 77.4,41.98 77.4,42.98 77.4,43.98 77.4,44.98 77.4,45.97 35.75,45.53 35.75,46.53 35.75,47.53 35.75,48.53 35.75,49.53 35.75,50.53 35.75,51.53 35.75,52.53 35.75,53.53 35.75,54.53 35.75,55.53 35.75,56.53 35.75,57.53 35.75,58.53 35.75,59.53 35.75,60.53 35.75,61.53 35.75,62.53 35.75,63.53 35.75,64.53 35.75,65.53 35.75,66.53 35.75,67.53 35.75,68.53 35.75,69.53 35.75,70.53 35.75,71.53 35.75,72.53 35.75,73.53 35.75,74.53 35.75,31.52 35.75,32.52 35.75,33.52 35.75,34.52 35.75,35.52 35.75,36.52 35.75,37.52 35.75,38.52 35.75,39.52 35.75,40.52 35.75,41.52 35.75,42.52 35.75,43.52 35.75,44.52 72.4,46.97 72.4,47.97 72.4,48.97 72.4,49.97 72.4,50.97 72.4,51.97 72.4,52.97 72.4,53.97 72.4,54.97 72.4,55.97 72.4,56.97 72.4,57.97 72.4,58.97 72.4,59.97 72.4,60.97 72.4,61.97 72.4,62.97 72.4,63.97 72.4,64.97 72.4,65.97 72.4,66.97 72.4,67.97 72.4,68.97 72.4,69.97 72.4,70.97 72.4,71.97 72.4,72.97 72.4,73.97 72.4,74.97 72.4,75.97 72.4,31.98 72.4,32.98 72.4,33.98 72.4,34.98 72.4,35.98 72.4,36.98 72.4,37.98 72.4,38.98 72.4,39.98 72.4,40.98 72.4,41.98 72.4,42.98 72.4,43.98 72.4,44.98 72.4,45.97 35.95,30.3 36.35,29.17 36.9,28.12 37.83,27.23 38.8,26.33 40.12,25.88 41.45,25.45 45.77,25.27 47,24.77 47.83,23.73 48.23,22.5 40.92,32.27 41.62,31.2 42.83,30.8 44.2,30.62 50.9,29.45 53.62,22.52 71.62,31.1 70.5,30.62 69.25,30.62 68.1,30.62 67.1,30.62 66.1,30.62 63.55,30.33 62.12,30.27 60.58,29.7 59.38,28.55 58.5,27.17 57.98,25.83 57.9,24.52 57.9,23.52 57.9,22.52 77.3,30.73 77.03,29.58 76.5,28.6 75.78,27.7 74.9,26.98 74,26.33 72.8,25.8 71.58,25.6 70.33,25.45 69.33,25.45 68.33,25.45 67.33,25.45 66.33,25.45 64.92,25.23 63.73,24.55 63.17,23.48 63.17,22.48 72.1,19.23 93.6,20.23 92.6,20.23 91.6,20.23 91.6,19.23 92.6,19.23 91.6,18.23 92.6,14.73 96.6,11.73 97.6,11.73 91.6,11.73 91.6,12.73 91.6,13.73 90.6,12.73 90.6,11.73 89.6,11.73 29.8,12.2 29.8,11.2 29.8,10.2 29.8,13.2 30.8,13.2 31.8,13.2 30.8,12.2 30.8,11.2 31.8,12.2 13.8,25.2 13.8,26.2 13.8,27.2 14.8,27.2 14.8,26.2 14.8,25.2 15.8,25.2 15.8,26.2 16.8,25.2 10.65,16.92 9.65,16.92 9.65,15.92 10.65,15.92 10.65,14.92 26.8,25.2 27.8,25.2 27.8,26.2 28.8,26.2 28.8,25.2 28.8,27.2 29.8,27.2 29.8,26.2 29.8,25.2 13.8,28.2 29.8,28.2 67,21.75 66,21.75 67,22.75 81.17,24.35 81.17,25.35 80.17,25.35 80.17,26.35 81.17,26.35 79.17,25.35 38.52,8.05 37.52,8.05 36.52,8.05 38.52,9.05 39.52,9.05 37.52,9.05 59.27,21.42 45.2,30.62 46.2,30.62 49.25,30.15 44.77,25.27 43.77,25.27 42.77,25.27 53.62,23.52 53.62,24.52 53.62,25.52 53.23,27.27 52.25,28.5 59.27,19.42 81.45,8.82 82.45,8.82 83.45,8.82 84.45,8.82 88.45,8.82 89.45,8.82 90.45,8.82 91.45,8.82 96.45,8.82 97.45,8.82 98.45,8.82 99.45,8.82 51.5,7.85 51.5,8.85 53.23,8.77 53.25,7.75 59.5,9.1 62.73,9.05 62.73,7.02 59.35,6.23 56.27,7.73 56.27,9.73 56.27,6.23 55.27,7.73 55.27,6.23 54.27,7.73 54.27,6.23 53.27,6.23 57.27,6.23 58.27,6.23 63.73,9.05 64.72,9.05 63.73,7.02 64.72,7.02 65.72,7.02 66.72,7.02 67.72,7.02 66.6,10.68 67.6,10.68 68.6,10.68 65.1,13.67 57.27,9.23 58.5,9.1 55.65,10.8 55.65,11.8 55.65,12.8 62.42,12.62 53,12.5 46,4.85 49,4.85 46,7.85 53.27,0.73 53.27,1.73 54.27,1.73 55.27,1.73 55.27,0.73 54.27,0.73 54.27,2.73 83.17,20.33 89.17,20.55 84.22,17.23 87.62,10.8 87.45,8.82 92.62,10.8 93.62,10.8 94.62,10.8 95.62,10.8 95.45,8.82 94.45,8.82 93.45,8.82 92.45,8.82 96.47,7.1 97.47,7.1 98.47,7.1 99.47,7.1 100.45,8.82 101.45,8.82 100.47,7.1 98.6,11.73
  pour Top (rank 5): -0.5,81 0,0 108,-0.5 108,80.5
  pour Bottom: 108.5,81 108.5,0 0,0 -0.5,81.5
  pour Top (no thermals): 43.5,4 43.5,0.5 44.5,0.5 44.5,4
  pour Top (no thermals): 50.5,4 50.5,0.5 51.5,0.5 51.5,4
  pour Top (no thermals): 57,4 57,0.5 58,0.5 58,4
  pour Top (no thermals): 64,4 64,0.5 65,0.5 65,4
  pour Top (no thermals): 34,80.5 34,77 35,77 35,80.5
  pour Top (no thermals): 40,80.5 40,77 41,77 41,80.5
  pour Top (no thermals): 71,80.5 71,77 72,77 72,80.5
  pour Top (no thermals): 78,80.5 78,77 79,77 79,80.5
GNDIN
  Top 0.152: J3.9 J3.8 J3.6
  Top 0.813: J3.9 102.54,12.96 101.55,13.95 100.67,13.95 Q8.3
LD  (via drill 0.3)
  Top 0.152: IC1.25 18.13,18.74 v17.3,19.58 | U1.12 71.73,15.4 v71.28,15.85
  Bottom 0.152: v71.28,15.85 70.83,16.3 49.77,16.3 39.65,6.18 29.55,6.18 29,6.73 16.5,6.73 14.3,8.93 13.97,8.93 13.65,9.25 13.65,11.05 12.65,12.05 12.65,12.52 12.82,12.7 12.82,15.2 13.95,16.33 13.95,17.3 15.6,18.95 16.68,18.95 v17.3,19.58
LE  (via drill 0.3)
  Top 0.152: R2.3 v21.77,9.68 | U1.14 71.64,13.8 v71.28,13.45 71.25,13.4 70.35,13.4 69.97,13.02 R14.1 | 31.55,7.12 v31.55,7.15 31.55,6.12 31.77,5.9 31.77,5.38 v32.35,4.8
  Bottom 0.152: v21.77,9.68 21.77,9.23 22.02,8.98 29.07,8.98 30.02,8.02 30.35,8.02 30.68,7.7 31,7.7 v31.55,7.15 | v71.28,13.45 70.67,14.02 70.67,14.4 69.45,15.62 50.02,15.62 39.88,5.48 33.27,5.48 32.6,4.8 v32.35,4.8
MISO  (via drill 0.3)
  Top 0.152: v75.3,12 74.75,12.55 74.25,12.55 73.89,12.2 U1.16 71.67,12.2 v71.28,11.8
  Bottom 0.152: v75.3,12 78.82,12 TP1.TP | v71.28,11.8 71.28,11.82 70.72,12.38 70.72,12.73 70.35,13.1 70.35,13.38 69.95,13.77 69.95,14.2 69.17,14.98 50.3,14.98 40.12,4.8 33.58,4.8 32.9,4.12 32.9,3.8 32.58,3.48 32.25,3.48 29.48,0.7 20.68,0.7 20.38,1 20.38,2.36 JP1.1
MOSI  (via drill 0.3)
  Top 0.152: R2.2 20.97,9.89 v20.75,9.68 | v76.4,12.88 75.97,12.57 75.22,12.57 74.81,13 U1.15 71.62,13 v71.28,12.65 | v32.35,4.02 31.8,4.57 31.8,4.88 31.45,5.23 31.45,5.68 30.77,6.35 v30.77,7.15
  Bottom 0.152: v20.75,9.68 20.75,9.18 21.27,8.65 28.93,8.65 29.9,7.68 30.25,7.68 v30.77,7.15 | v76.4,12.88 76.95,13.42 76.92,14.42 77.1,14.6 77.1,15.36 TP5.TP | v71.28,12.65 70.7,13.23 70.7,13.52 70.33,13.9 70.33,14.27 69.3,15.3 50.15,15.3 40,5.15 33.48,5.15 v32.35,4.02
MUX_OUT  (via drill 0.3)
  Top 0.152: IC1.30 17.7,16.24 v17.27,15.83 | v13.18,16.98 15.15,16.98 v15.18,16.95
  Top 0.305: IC1.30 18.87,16.24
  Bottom 0.152: JP1.2 21.41,3.29 21.1,3.6 18.95,3.6 16.73,5.82 16.3,5.82 14.07,8.05 13.68,8.05 12.88,8.85 12.88,10.7 11.88,11.7 11.88,12.82 12.03,12.98 12.03,15.83 v13.18,16.98 | v15.18,16.95 16.15,16.95 v17.27,15.83
N$1
  Top 0.152: 19.64,19.42 IC1.24 19.68,19.46 19.68,19.95 19.5,20.12 16.5,20.12 16.21,19.84 C5.1
  Top 0.406: C5.1 C6.1
N$2
  Top 0.152: R1.1 18.12,21.1 18.35,20.88 19.9,20.88 20.65,20.12 IC1.22
N$3
  Top 0.152: IC1.1 19.66,13.52 20.15,13.02 20.15,12.25 R2.8
N$4
  Top 0.152: R2.7 20.95,12.25 20.95,12.73 20.16,13.52 IC1.2
N$5
  Top 0.152: IC1.3 20.66,13.47 21.2,12.93 21.6,12.93 21.8,12.73 21.8,12.25 R2.6
N$6
  Top 0.152: IC1.19 22.16,20.28 22.6,20.73 C1.1
  Top 0.406: C1.1 C2.1
N$7
  Top 0.152: C3.1 16.21,20.87 16.55,20.52 19.75,20.52 20.15,20.12 IC1.23
  Top 0.406: C4.1 C3.1
N$8  (via drill 0.3)
  Top 0.152: IC1.26 17.63,18.24 v17.3,18.58 | R21.2 13.31,12.29 v13.3,12.27
  Bottom 0.254: v17.3,18.58 15.75,18.58 14.32,17.15 14.32,16.17 13.2,15.05 13.2,12.38 v13.3,12.27
N$9
  Top 0.152: IC1.4 21.16,13.47 21.35,13.27 21.75,13.27 22.1,12.93 22.35,12.93 22.55,12.73 22.55,12.25 R2.5
N$10  (via drill 0.3)
  Top 0.152: R6.1 28.43,7.47 28.15,7.75 v27.48,7.75 | v19.6,8.62 C22.1 | IC1.20 21.66,20.61 v21.73,20.67
  Bottom 0.254: v27.48,7.75 20.48,7.75 v19.6,8.62 19.12,9.1 19.12,11.52 18.62,12.02 18.62,12.57 19.12,13.08 19.12,18.73 21.07,20.67 v21.73,20.67
N$11
  Top 0.254: IC5.3 46.25,18.6 45.08,17.42 45.08,15.52 44.84,15.28 R3.1
N$12
  Top 0.254: 24.85,16.75 24.84,16.74 25.01,16.74
  Top 0.305: IC1.12 24.84,16.74 | 25.01,16.74 arc45 27.04,17.59 27.75,18.3 arc-45 29.18,18.89 C17.1
  Top 0.406: C17.1 arc45 30.64,18.88 R4.2
N$13
  Top 0.152: 30.61,20.45 arc-90 C18.1
  Top 0.254: 24.84,17.24 24.85,17.25 24.99,17.25
  Top 0.305: IC1.13 24.84,17.24 | 24.99,17.25 arc45 26.76,17.98 28.47,19.7 arc-45 30.27,20.44 C18.1
  Top 0.406: 30.61,20.45 arc45 30.64,20.52 R5.2
N$14
  Top 0.254: C18.2 arc45 32.22,20.31 FL1.4
N$15
  Top 0.254: C17.2 arc-45 32.19,18.99 FL1.6
N$16
  Top 0.406: R7.2 26.47,6.91 C23.2
N$17  (via drill 0.3)
  Top 0.152: IC1.29 17.42,16.74 v17.27,16.6 | C25.2 16.85,8.62 17.15,8.93 v17.15,9.57
  Top 0.254: R11.1 12.25,9.35 12.97,8.62 R10.2
  Top 0.406: R10.2 C25.2
  Bottom 0.152: v17.27,16.6 17.65,16.6 18.3,15.95 18.3,13.52 17.8,13.02 17.8,10.23 v17.15,9.57
N$18
  Top 0.254: C21.1 FL1.2 arc90 FL1.2
N$19
  Top 0.406: LED1.A 69.98,23.2 R20.1
N$20
  Top 0.152: C26.2 76.78,21.6 76.48,21.3 Y1.3 75.7,20.42 75.55,20.27 75.17,20.27 75,20.09 U1.7
N$21
  Top 0.152: 74.19,19.05 U1.8 74.2,20.08 74.38,20.25 74.58,20.25 74.78,20.45 74.78,22.3 74.53,22.55 74.03,22.55 73.83,22.75 73.83,23.58 | 73.83,23.58 Y1.1 | 73.83,23.58 73.08,23.58 72.8,23.3 C27.2
N$22
  Top 0.254: IC2.2 61.13,11.64 60.8,11.98 59.95,11.98 59.58,11.6 58.81,11.6 R16.1
N$23
  Top 0.305: C40.2 50.58,9.62 arc90 51.02,10.07 IC3.1
  Top 0.406: C40.2 R23.2 R24.1
N$24
  Top 0.254: R16.2 60.53,13.28 61.8,14.55 61.8,16.53 IC2.6 | 61.9,18.88 61.78,18.88 61.78,17.78
  Top 0.305: IC2.6 61.78,17.78 | 61.9,18.88 C35.1 | L1.2 63.83,19.09 C34.1
  Top 0.406: C35.1 C34.1 63.92,19.03
N$25
  Top 0.254: IC3.2 51.67,11.62 51.3,12 51.27,12 51.25,12.02 50.6,12.02 50.17,11.6 49.37,11.6 R15.1
N$27
  Top 0.254: R15.2 51.19,13.28 52.27,14.38 52.27,16.5 IC3.6 | 52.33,16.92 52.33,17.73 52.5,17.9 C31.1
  Top 0.305: IC3.6 52.33,16.92
  Top 0.406: C31.1 C32.1 54.55,19.03 L2.2
N$28  (via drill 0.3)
  Top 0.305: IC4.6 91.06,22.91 v91.4,23.25 91.45,23.3 C38.1 92.36,23.25 | IC4.4 v91.19,21.6 v91.2,21.6
  Top 0.406: L3.2 94.44,23.18 C36.1 C38.1
  Bottom 0.305: v91.2,21.6 91.2,23.05 v91.4,23.25
N$29  (via drill 0.3)
  Top 0.152: R19.1 89.38,17.97 89.15,18.2 v89.15,18.8 | v87.35,21.6 IC4.3
  Bottom 0.254: v89.15,18.8 87.35,20.6 v87.35,21.6
N$30
  Top 0.406: IC6.6 46.05,14.73 45.45,14.12 C43.1 R24.2
PPS_IN
  Top 0.305: 60.5,10.66 IC2.1
  Top 0.406: 60.5,10.66 60.5,7.93 arc90 60.75,7.62 arc-90 60.98,7.4 J6.1
PPS_PLL  (via drill 0.3)
  Top 0.305: v25.15,1.88 39.48,1.88 arc90 41.4,3.8 41.4,4.45 arc-90 43.95,7 v45,7 | v61.8,7 61.8,10.66 IC2.3
  Bottom 0.305: v25.15,1.88 JP1.3 arc90 JP1.3 | v45,7 v61.8,7
PPS_RPI  (via drill 0.3)
  Top 0.152: IC7.3 84.98,19.27 85.47,18.77 86.78,18.77 87.1,18.45 87.1,16.95 86.8,16.65 86.8,16.23 86.2,15.62 v86.2,15.12 | v86.2,12.12 v86.2,9.5
  Top 0.254: IC2.5 62.43,15.07 arc90 v64,13.5
  Bottom 0.152: v86.2,15.12 v86.2,12.12
  Bottom 0.254: J3.7 arc90 J3.7
  Bottom 0.406: J3.7 101.22,14.23 arc90 99.5,12.5 99.5,12 arc-90 97,9.5 v86.2,9.5 66.5,9.5 arc-90 64,12.5 v64,13.5
PPS_USRP
  Top 0.254: IC2.8 arc90 60.5,16.57
  Top 0.406: IC2.8 arc90 60.5,16.57 60.5,22.9
  Top 0.813: J1.1 74.9,75.8
  Top 0.892: 74.9,75.8 74.9,32.5 arc-90 70.42,28.02 65.17,28.02 arc90 60.48,23.33 60.48,22.92 arc90 60.5,22.9
RESET  (via drill 0.3)
  Top 0.152: v76.55,14.83 77.12,15.4 U1.29 82,15.4 82.05,15.35 82.83,15.35 83.15,15.02 83.15,14.5 83.3,14.35 84.12,14.35 R12.1
  Bottom 0.152: v76.55,14.83 v76.55,14.82 TP3.TP
RF_OUT
  Top 0.9: C21.2 arc-90 38.3,19.02 J5.1
RFOUT_EN  (via drill 0.3)
  Top 0.152: U1.11 71.7,16.2 v71.28,16.62 | v14.2,9.65 R21.1
  Bottom 0.152: v71.28,16.62 49.62,16.62 39.5,6.5 29.68,6.5 29.12,7.05 16.62,7.05 14.2,9.48 v14.2,9.65
SCL  (via drill 0.3)
  Top 0.152: R18.1 88.2,17.33 87.83,16.95 87.6,16.95 87.2,16.55 v87.2,15.73 | U1.28 82.37,14.59 v82.58,14.8
  Bottom 0.152: J3.5 103.4,15.5 102.92,15.98 87.95,15.98 87.7,15.73 v87.2,15.73 83.2,15.73 82.58,15.1 v82.58,14.8
SDA  (via drill 0.3)
  Top 0.152: U1.27 82.37,13.8 v82.58,14 | v85.25,15.12 v85.25,16.95 85.8,16.95 86.12,17.27 86.12,17.9 R17.1
  Bottom 0.152: J3.4 106.28,17.62 106.28,18.42 105.5,19.2 103.55,19.2 101.3,16.95 v85.25,16.95 | v82.58,14 83.12,14.55 83.12,15.2 83.3,15.38 85,15.38 v85.25,15.12
SW
  Top 0.152: IC1.5 21.66,13.77 21.8,13.62 21.9,13.62 22.25,13.27 22.5,13.27 23.1,12.68 23.1,10.1 23.85,9.35 24.35,9.35 24.5,9.2 R7.1
  Top 0.406: R8.2 R7.1
V_BUFFER  (via drill 0.3)
  Top 0.254: IC5.1 v45.4,20.45 | L2.1 56.16,20.5 v56.92,20.5 57.75,20.5 C30.1 | L1.1 66.12,20.53 v66.12,20.52 | R3.2 v44.1,17.73 | v43.25,20.65 44.62,20.65
  Top 0.406: 43.98,20.53 C33.1 44.62,20.65 45.2,20.65 v45.4,20.45
  Bottom 0.254: v66.12,20.52 56.95,20.52 v56.92,20.5 | v44.1,17.73 44.1,19.8 v43.25,20.65
  Bottom 0.305: v45.4,20.45 56.88,20.45 v56.92,20.5 | JP2.2 66.95,19.7 v66.12,20.52

### Text on the board
tNames: 10MHz OUT | PPS OUT | RPI | 10 MHz IN | PPS IN
bNames: ICSP | BUFFER / VDD | Techtile PLL / Version 1 - 14/11/23 / by G. Leenders / dramco.be/techtile | PLL OUT | RF BOARD | MUX | MISO | PPS